# EAGLE design 2021-03-01_HALO_Main_Board (EAGLE 9.6.2)
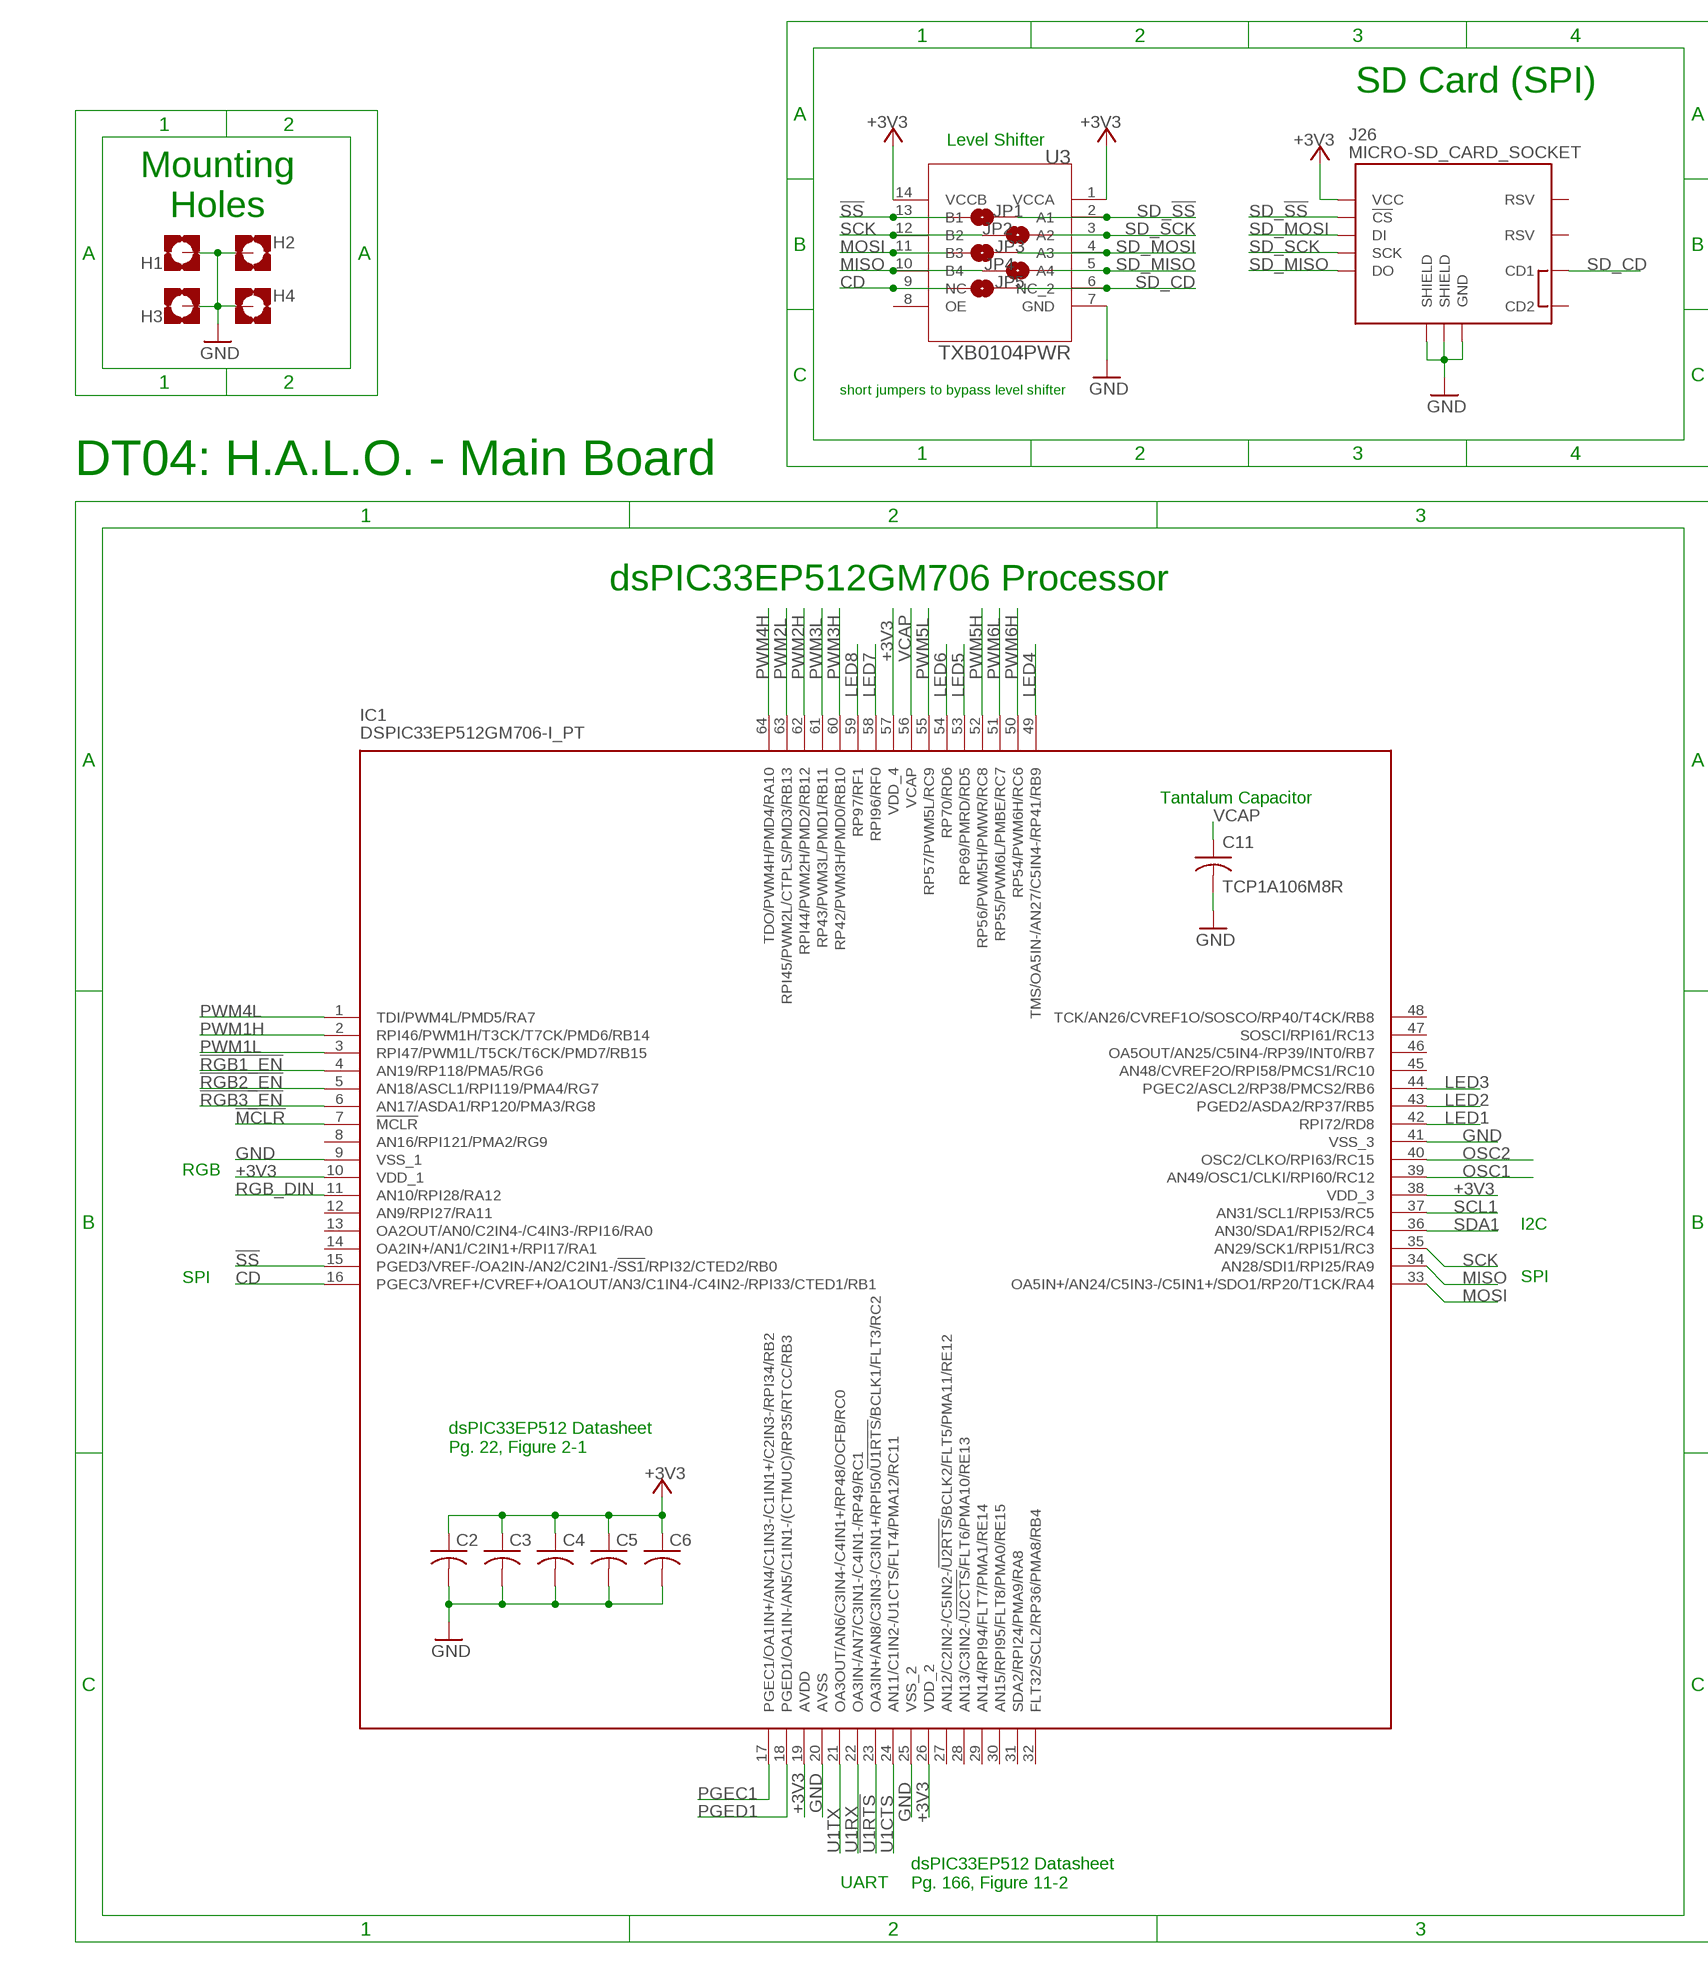
[diagram p0: schematic, sheet 1, part 1 of 2]
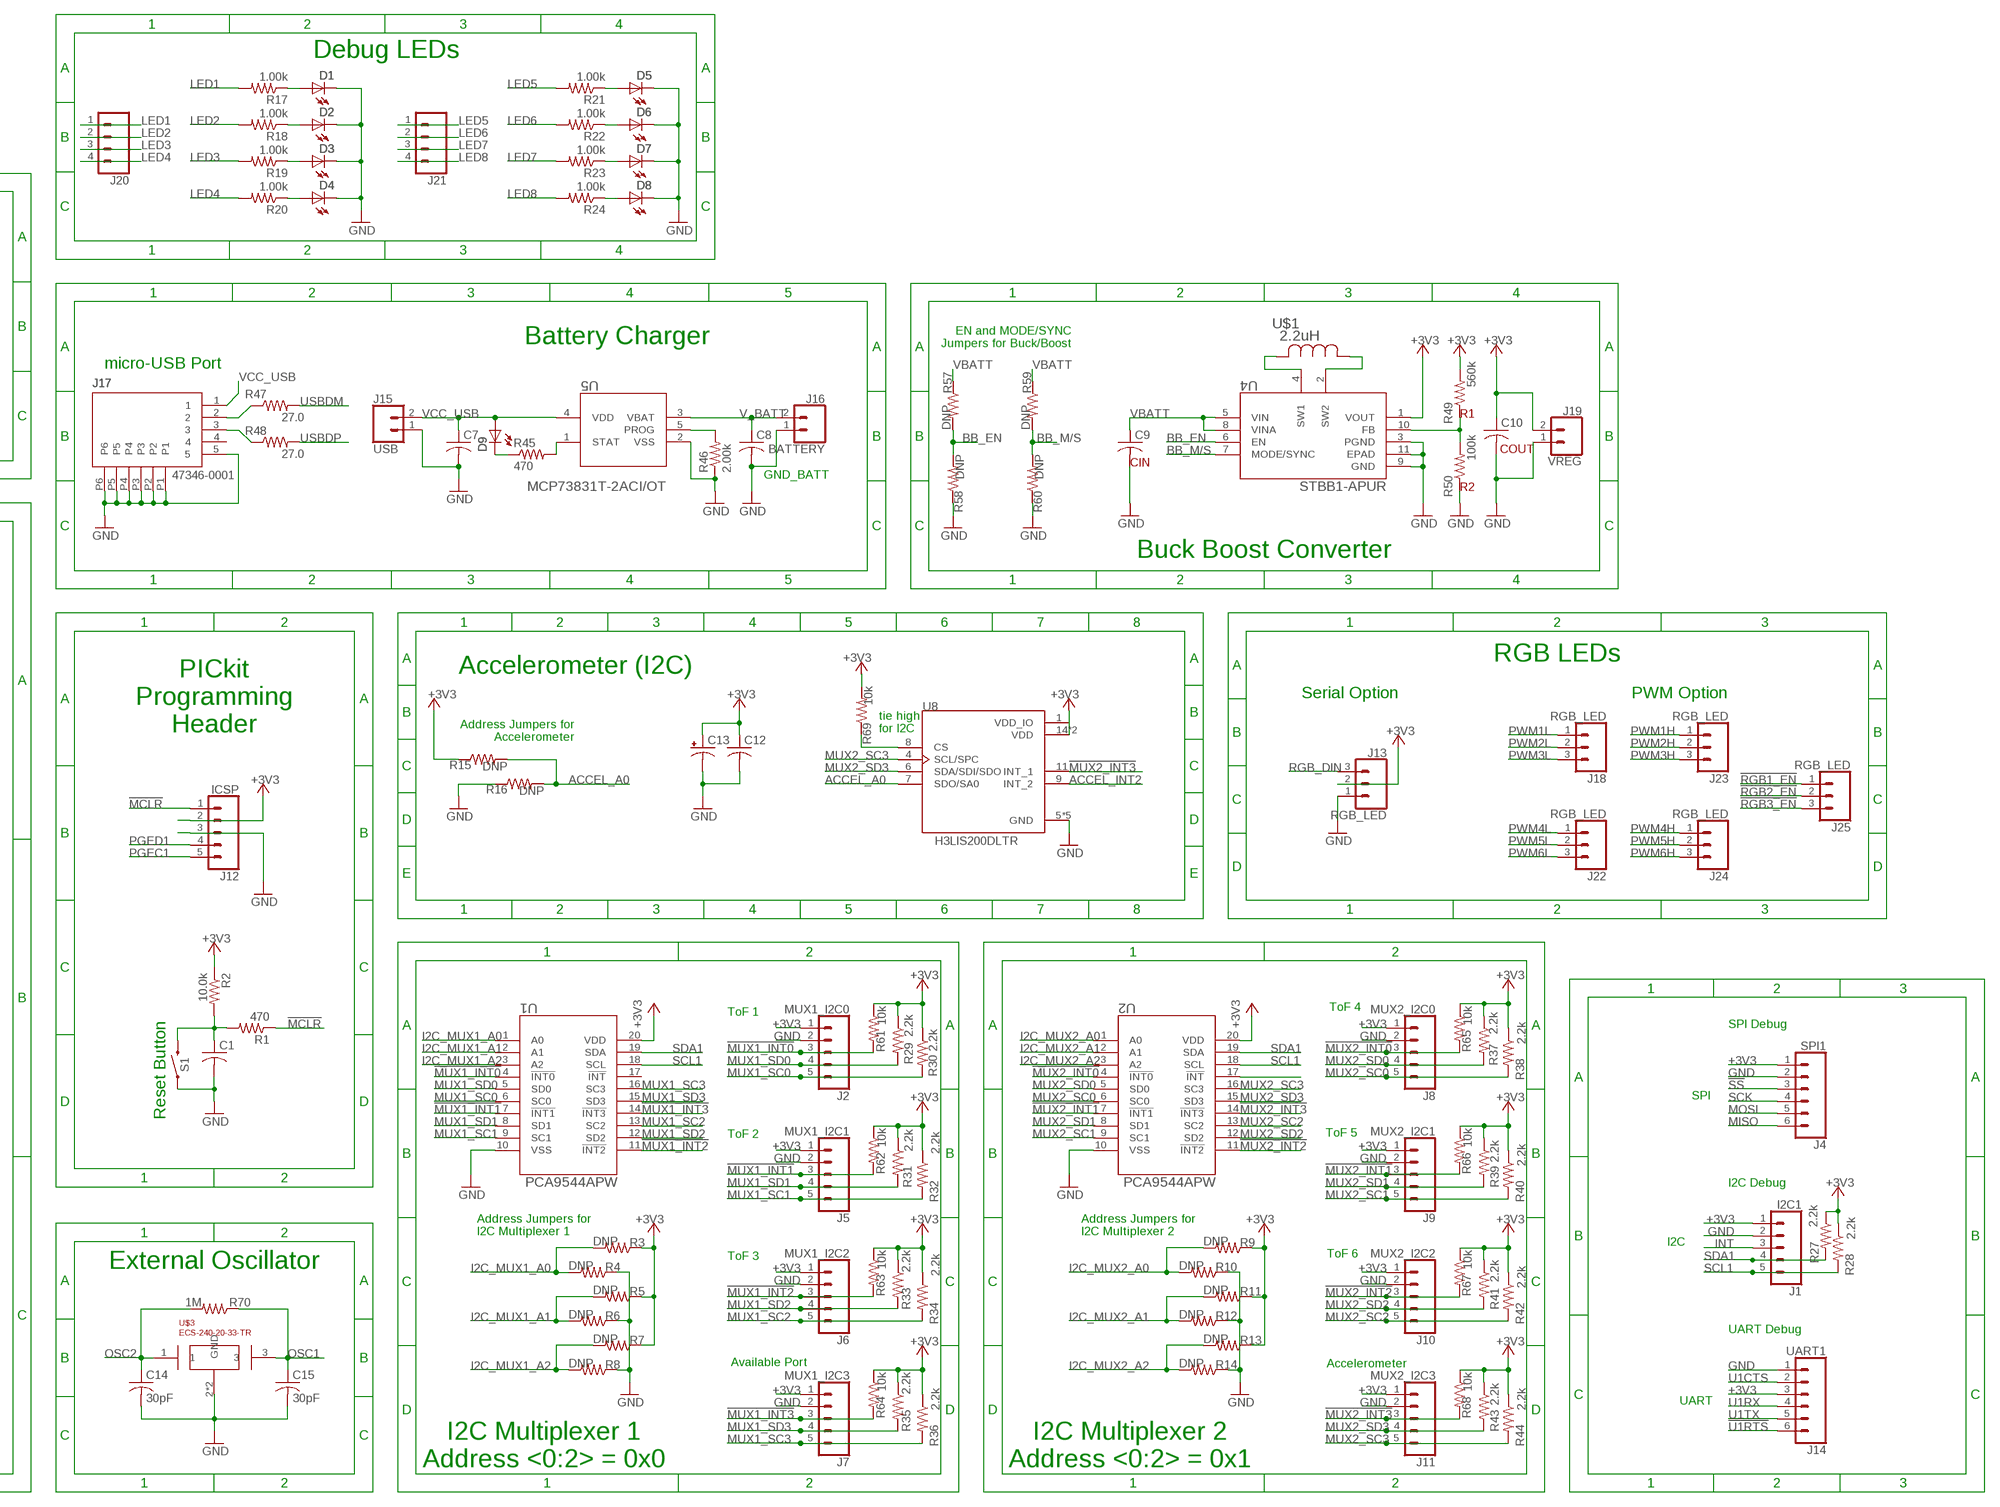
[diagram p1: schematic, sheet 1, part 2 of 2]

## Parts
C1  0.1uF  C-USC0805  [C0805]
C2  0.1uF  C-USC0805  [C0805]
C3  0.1uF  C-USC0805  [C0805]
C4  0.1uF  C-USC0805  [C0805]
C5  0.1uF  C-USC0805  [C0805]
C6  0.1uF  C-USC0805  [C0805]
C7  4.7uF  C-USC0805  [C0805]
C8  4.7uF  C-USC0805  [C0805]
C9  10uF  C-USC0805  [C0805]
C10  22uF  C-USC0805  [C0805]
C11  TCP1A106M8R  [TCP_ROM]
C12  0.1uF  C-USC0805  [C0805]
C13  10uF  10UF-POLAR-EIA3216-16V-10%(TANT)  [EIA3216]
C14  30pF  C-USC0805  [C0805]
C15  30pF  C-USC0805  [C0805]
D1  CHIP-LED0805  [CHIP-LED0805]
D2  CHIP-LED0805  [CHIP-LED0805]
D3  CHIP-LED0805  [CHIP-LED0805]
D4  CHIP-LED0805  [CHIP-LED0805]
D5  CHIP-LED0805  [CHIP-LED0805]
D6  CHIP-LED0805  [CHIP-LED0805]
D7  CHIP-LED0805  [CHIP-LED0805]
D8  CHIP-LED0805  [CHIP-LED0805]
D9  CHIP-LED0805  [CHIP-LED0805]
H1  MOUNT-PAD-SQUARE3.0  [3,0-PAD-SQUARE]
H2  MOUNT-PAD-SQUARE3.0  [3,0-PAD-SQUARE]
H3  MOUNT-PAD-SQUARE3.0  [3,0-PAD-SQUARE]
H4  MOUNT-PAD-SQUARE3.0  [3,0-PAD-SQUARE]
IC1  DSPIC33EP512GM706-I_PT  [QFP50P1200X1200X120-64N]
J1  I2C1  CONN_05  [1X05]
J2  MUX1_I2C0  CONN_05  [1X05]
J4  SPI1  CONN_06SILK_FEMALE_PTH  [1X06]
J5  MUX1_I2C1  CONN_05  [1X05]
J6  MUX1_I2C2  CONN_05  [1X05]
J7  MUX1_I2C3  CONN_05  [1X05]
J8  MUX2_I2C0  CONN_05  [1X05]
J9  MUX2_I2C1  CONN_05  [1X05]
J10  MUX2_I2C2  CONN_05  [1X05]
J11  MUX2_I2C3  CONN_05  [1X05]
J12  ICSP  CONN_05  [1X05]
J13  RGB_LED  CONN_03LOCK  [1X03_LOCK]
J14  UART1  CONN_06SILK_FEMALE_PTH  [1X06]
J15  USB  CONN_02  [1X02]
J16  BATTERY  CONN_02  [1X02]
J17  47346-0001  AS-ITM-00021  [MICRO_USB]
J18  RGB_LED  CONN_03LOCK  [1X03_LOCK]
J19  VREG  CONN_02  [1X02]
J20  CONN_04  [1X04]
J21  CONN_04  [1X04]
J22  RGB_LED  CONN_03LOCK  [1X03_LOCK]
J23  RGB_LED  CONN_03LOCK  [1X03_LOCK]
J24  RGB_LED  CONN_03LOCK  [1X03_LOCK]
J25  RGB_LED  CONN_03LOCK  [1X03_LOCK]
J26  MICRO-SD_CARD_SOCKET  [MICRO-SD-SOCKET]
JP1  JUMPER-SMT_2_NO_NO-SILK  [SMT-JUMPER_2_NO_NO-SILK]
JP2  JUMPER-SMT_2_NO_NO-SILK  [SMT-JUMPER_2_NO_NO-SILK]
JP3  JUMPER-SMT_2_NO_NO-SILK  [SMT-JUMPER_2_NO_NO-SILK]
JP4  JUMPER-SMT_2_NO_NO-SILK  [SMT-JUMPER_2_NO_NO-SILK]
JP5  JUMPER-SMT_2_NO_NO-SILK  [SMT-JUMPER_2_NO_NO-SILK]
R1  470  R-US_R0805  [R0805]
R2  10.0k  R-US_R0805  [R0805]
R3  DNP  R-US_R0805  [R0805]
R4  DNP  R-US_R0805  [R0805]
R5  DNP  R-US_R0805  [R0805]
R6  DNP  R-US_R0805  [R0805]
R7  DNP  R-US_R0805  [R0805]
R8  DNP  R-US_R0805  [R0805]
R9  DNP  R-US_R0805  [R0805]
R10  DNP  R-US_R0805  [R0805]
R11  DNP  R-US_R0805  [R0805]
R12  DNP  R-US_R0805  [R0805]
R13  DNP  R-US_R0805  [R0805]
R14  DNP  R-US_R0805  [R0805]
R15  DNP  R-US_R0805  [R0805]
R16  DNP  R-US_R0805  [R0805]
R17  1.00k  R-US_R0805  [R0805]
R18  1.00k  R-US_R0805  [R0805]
R19  1.00k  R-US_R0805  [R0805]
R20  1.00k  R-US_R0805  [R0805]
R21  1.00k  R-US_R0805  [R0805]
R22  1.00k  R-US_R0805  [R0805]
R23  1.00k  R-US_R0805  [R0805]
R24  1.00k  R-US_R0805  [R0805]
R27  2.2k  R-US_R0805  [R0805]
R28  2.2k  R-US_R0805  [R0805]
R29  2.2k  R-US_R0805  [R0805]
R30  2.2k  R-US_R0805  [R0805]
R31  2.2k  R-US_R0805  [R0805]
R32  2.2k  R-US_R0805  [R0805]
R33  2.2k  R-US_R0805  [R0805]
R34  2.2k  R-US_R0805  [R0805]
R35  2.2k  R-US_R0805  [R0805]
R36  2.2k  R-US_R0805  [R0805]
R37  2.2k  R-US_R0805  [R0805]
R38  2.2k  R-US_R0805  [R0805]
R39  2.2k  R-US_R0805  [R0805]
R40  2.2k  R-US_R0805  [R0805]
R41  2.2k  R-US_R0805  [R0805]
R42  2.2k  R-US_R0805  [R0805]
R43  2.2k  R-US_R0805  [R0805]
R44  2.2k  R-US_R0805  [R0805]
R45  470  R-US_R0805  [R0805]
R46  2.00k  R-US_R0805  [R0805]
R47  27.0  R-US_R0805  [R0805]
R48  27.0  R-US_R0805  [R0805]
R49  560k  R-US_R0805  [R0805]
R50  100k  R-US_R0805  [R0805]
R57  DNP  R-US_R0805  [R0805]
R58  DNP  R-US_R0805  [R0805]
R59  DNP  R-US_R0805  [R0805]
R60  DNP  R-US_R0805  [R0805]
R61  10k  R-US_R0805  [R0805]
R62  10k  R-US_R0805  [R0805]
R63  10k  R-US_R0805  [R0805]
R64  10k  R-US_R0805  [R0805]
R65  10k  R-US_R0805  [R0805]
R66  10k  R-US_R0805  [R0805]
R67  10k  R-US_R0805  [R0805]
R68  10k  R-US_R0805  [R0805]
R69  10k  R-US_R0805  [R0805]
R70  1M  R-US_R0805  [R0805]
S1  SWITCH-MOMENTARY-2SMD-4  [TACTILE_SWITCH_TALL]
U1  PCA9544APW  [SOT360-1_NXP]
U2  PCA9544APW  [SOT360-1_NXP]
U3  TXB0104PWR  [PW14]
U4  STBB1-APUR  [SON_B1-APUR_STM]
U5  MCP73831T-2ACI/OT  [SOT-23-5_MC_MCH]
U8  H3LIS200DLTR  [PQFN50P300X300X100-16N]
U$1  2.2uH  IND  [IND_4028_TDK]
U$3  ECS-240-20-33-TR  [ECX-32]

## Nets
!MCLR: IC1.7(!MCLR) J12.1 R1.1
!MUX1_INT0: J2.3 R61.2 U1.4(!INT0)
!MUX1_INT1: J5.3 R62.2 U1.7(!INT1)
!MUX1_INT2: J6.3 R63.2 U1.11(!INT2)
!MUX1_INT3: J7.3 R64.2 U1.14(!INT3)
!MUX2_INT0: J8.3 R65.2 U2.4(!INT0)
!MUX2_INT1: J9.3 R66.2 U2.7(!INT1)
!MUX2_INT2: J10.3 R67.2 U2.11(!INT2)
!MUX2_INT3: J11.3 R68.2 U2.14(!INT3) U8.11(INT_1)
!RGB1_EN: IC1.4(AN19/RP118/PMA5/RG6) J25.1
!RGB2_EN: IC1.5(AN18/ASCL1/RPI119/PMA4/RG7) J25.2
!RGB3_EN: IC1.6(AN17/ASDA1/RP120/PMA3/RG8) J25.3
!SS: IC1.15(PGED3/VREF-/OA2IN-/AN2/C2IN1-/!SS1!/RPI32/CTED2/RB0) J4.3 JP1.2 U3.13(B1)
!U1RTS: IC1.23(OA3IN+/AN8/C3IN3-/C3IN1+/RPI50/!U1RTS!/BCLK1/FLT3/RC2) J14.6
+3V3: C2.1 C3.1 C4.1 C5.1 C6.1 C10.1 C12.1 C13.+ IC1.10(VDD_1) IC1.19(AVDD) IC1.26(VDD_2) IC1.38(VDD_3) IC1.57(VDD_4) J1.1 J2.1 J4.1 J5.1 J6.1 J7.1 J8.1 J9.1 J10.1 J11.1 J12.2 J13.2 J14.3 J19.2 J26.VCC R2.1 R3.1 R5.1 R7.1 R9.1 R11.1 R13.1 R15.1 R27.1 R28.1 R29.1 R30.1 R31.1 R32.1 R33.1 R34.1 R35.1 R36.1 R37.1 R38.1 R39.1 R40.1 R41.1 R42.1 R43.1 R44.1 R49.2 R61.1 R62.1 R63.1 R64.1 R65.1 R66.1 R67.1 R68.1 R69.2 U1.20(VDD) U2.20(VDD) U3.1(VCCA) U3.14(VCCB) U4.1(VOUT) U8.1(VDD_IO) U8.14(VDD) U8.15(VDD)
ACCEL_A0: R15.2 R16.2 U8.7(SDO/SA0)
ACCEL_INT2: U8.9(INT_2)
BB_EN: R57.2 R58.2 U4.6(EN)
BB_M/S: R59.2 R60.2 U4.7(MODE/SYNC)
CD: IC1.16(PGEC3/VREF+/CVREF+/OA1OUT/AN3/C1IN4-/C4IN2-/RPI33/CTED1/RB1) JP5.2 U3.9(NC)
GND: C1.2 C2.2 C3.2 C4.2 C5.2 C6.2 C7.2 C8.2 C9.2 C10.2 C11.2 C12.2 C13.- C14.2 C15.2 D1.C D2.C D3.C D4.C D5.C D6.C D7.C D8.C H1.B3,0(MOUNT) H2.B3,0(MOUNT) H3.B3,0(MOUNT) H4.B3,0(MOUNT) IC1.9(VSS_1) IC1.20(AVSS) IC1.25(VSS_2) IC1.41(VSS_3) J1.2 J2.2 J4.2 J5.2 J6.2 J7.2 J8.2 J9.2 J10.2 J11.2 J12.3 J13.1 J14.1 J15.1 J16.1 J17.5 J17.P1 J17.P2 J17.P3 J17.P4 J17.P5 J17.P6 J19.1 J26.GND J26.GND1(SHIELD) J26.GND3(SHIELD) R4.1 R6.1 R8.1 R10.1 R12.1 R14.1 R16.1 R46.1 R50.1 R58.1 R60.1 S1.A2 U1.10(VSS) U2.10(VSS) U3.7(GND) U4.3(PGND) U4.9(GND) U4.11(EPAD) U5.2(VSS) U8.5(GND) U8.10(GND) U8.12(GND) U8.13(GND) U8.16(GND) U$3.2(GND) U$3.4(GND)
I2C_MUX1_A0: R3.2 R4.2 U1.1(A0)
I2C_MUX1_A1: R5.2 R6.2 U1.2(A1)
I2C_MUX1_A2: R7.2 R8.2 U1.3(A2)
I2C_MUX2_A0: R9.2 R10.2 U2.1(A0)
I2C_MUX2_A1: R11.2 R12.2 U2.2(A1)
I2C_MUX2_A2: R13.2 R14.2 U2.3(A2)
INT: J1.3
LED1: IC1.42(RPI72/RD8) J20.1 R17.2
LED2: IC1.43(PGED2/ASDA2/RP37/RB5) J20.2 R18.2
LED3: IC1.44(PGEC2/ASCL2/RP38/PMCS2/RB6) J20.3 R19.2
LED4: IC1.49(TMS/OA5IN-/AN27/C5IN4-/RP41/RB9) J20.4 R20.2
LED5: IC1.53(RP69/PMRD/RD5) J21.1 R21.2
LED6: IC1.54(RP70/RD6) J21.2 R22.2
LED7: IC1.58(RPI96/RF0) J21.3 R23.2
LED8: IC1.59(RP97/RF1) J21.4 R24.2
MISO: IC1.34(AN28/SDI1/RPI25/RA9) J4.6 JP4.2 U3.10(B4)
MOSI: IC1.33(OA5IN+/AN24/C5IN3-/C5IN1+/SDO1/RP20/T1CK/RA4) J4.5 JP3.2 U3.11(B3)
MUX1_SC0: J2.5 R30.2 U1.6(SC0)
MUX1_SC1: J5.5 R32.2 U1.9(SC1)
MUX1_SC2: J6.5 R34.2 U1.13(SC2)
MUX1_SC3: J7.5 R36.2 U1.16(SC3)
MUX1_SD0: J2.4 R29.2 U1.5(SD0)
MUX1_SD1: J5.4 R31.2 U1.8(SD1)
MUX1_SD2: J6.4 R33.2 U1.12(SD2)
MUX1_SD3: J7.4 R35.2 U1.15(SD3)
MUX2_SC0: J8.5 R38.2 U2.6(SC0)
MUX2_SC1: J9.5 R40.2 U2.9(SC1)
MUX2_SC2: J10.5 R42.2 U2.13(SC2)
MUX2_SC3: J11.5 R44.2 U2.16(SC3) U8.4(SCL/SPC)
MUX2_SD0: J8.4 R37.2 U2.5(SD0)
MUX2_SD1: J9.4 R39.2 U2.8(SD1)
MUX2_SD2: J10.4 R41.2 U2.12(SD2)
MUX2_SD3: J11.4 R43.2 U2.15(SD3) U8.6(SDA/SDI/SDO)
N$1: C1.1 R1.2 R2.2 S1.B2
N$2: R69.1 U8.8(CS)
N$5: D1.A R17.1
N$6: J17.2 R47.1
N$7: D2.A R18.1
N$8: D9.C R45.1
N$9: R49.1 R50.2 U4.10(FB)
N$10: D3.A R19.1
N$11: D4.A R20.1
N$12: D5.A R21.1
N$13: D6.A R22.1
N$14: D7.A R23.1
N$15: D8.A R24.1
N$16: R45.2 U5.1(STAT)
N$17: J17.3 R48.1
N$18: U4.4(SW1) U$1.2
N$19: R46.2 U5.5(PROG)
N$20: U4.2(SW2) U$1.1
N$25: U2.17(!INT)
OSC1: C15.1 IC1.39(AN49/OSC1/CLKI/RPI60/RC12) R70.1 U$3.3
OSC2: C14.1 IC1.40(OSC2/CLKO/RPI63/RC15) R70.2 U$3.1
PGEC1: IC1.17(PGEC1/OA1IN+/AN4/C1IN3-/C1IN1+/C2IN3-/RPI34/RB2) J12.5
PGED1: IC1.18(PGED1/OA1IN-/AN5/C1IN1-/(CTMUC)/RP35/RTCC/RB3) J12.4
PWM1H: IC1.2(RPI46/PWM1H/T3CK/T7CK/PMD6/RB14) J23.1
PWM1L: IC1.3(RPI47/PWM1L/T5CK/T6CK/PMD7/RB15) J18.1
PWM2H: IC1.62(RPI44/PWM2H/PMD2/RB12) J23.2
PWM2L: IC1.63(RPI45/PWM2L/CTPLS/PMD3/RB13) J18.2
PWM3H: IC1.60(RP42/PWM3H/PMD0/RB10) J23.3
PWM3L: IC1.61(RP43/PWM3L/PMD1/RB11) J18.3
PWM4H: IC1.64(TDO/PWM4H/PMD4/RA10) J24.1
PWM4L: IC1.1(TDI/PWM4L/PMD5/RA7) J22.1
PWM5H: IC1.52(RP56/PWM5H/PMWR/RC8) J24.2
PWM5L: IC1.55(RP57/PWM5L/RC9) J22.2
PWM6H: IC1.50(RP54/PWM6H/RC6) J24.3
PWM6L: IC1.51(RP55/PWM6L/PMBE/RC7) J22.3
RGB_DIN: IC1.11(AN10/RPI28/RA12) J13.3
SCK: IC1.35(AN29/SCK1/RPI51/RC3) J4.4 JP2.2 U3.12(B2)
SCL1: IC1.37(AN31/SCL1/RPI53/RC5) J1.5 R28.2 U1.18(SCL) U2.18(SCL)
SD_!SS: J26.CS(!CS) JP1.1 U3.2(A1)
SD_CD: J26.CD1 JP5.1 U3.6(NC_2)
SD_MISO: J26.DO JP4.1 U3.5(A4)
SD_MOSI: J26.DI JP3.1 U3.4(A3)
SD_SCK: J26.SCLK(SCK) JP2.1 U3.3(A2)
SDA1: IC1.36(AN30/SDA1/RPI52/RC4) J1.4 R27.2 U1.19(SDA) U2.19(SDA)
U1CTS: IC1.24(AN11/C1IN2-/U1CTS/FLT4/PMA12/RC11) J14.2
U1RX: IC1.22(OA3IN-/AN7/C3IN1-/C4IN1-/RP49/RC1) J14.4
U1TX: IC1.21(OA3OUT/AN6/C3IN4-/C4IN1+/RP48/OCFB/RC0) J14.5
USBDM: R47.2
USBDP: R48.2
V_BATT: C8.1 J16.2 U5.3(VBAT)
VBATT: C9.1 R57.1 R59.1 U4.5(VIN) U4.8(VINA)
VCAP: C11.1 IC1.56(VCAP)
VCC_USB: C7.1 D9.A J15.2 J17.1 U5.4(VDD)
Unconnected: IC1.8(AN16/RPI121/PMA2/RG9) IC1.12(AN9/RPI27/RA11) IC1.13(OA2OUT/AN0/C2IN4-/C4IN3-/RPI16/RA0) IC1.14(OA2IN+/AN1/C2IN1+/RPI17/RA1) IC1.27(AN12/C2IN2-/C5IN2-/!U2RTS!/BCLK2/FLT5/PMA11/RE12) IC1.28(AN13/C3IN2-/!U2CTS!/FLT6/PMA10/RE13) IC1.29(AN14/RPI94/FLT7/PMA1/RE14) IC1.30(AN15/RPI95/FLT8/PMA0/RE15) IC1.31(SDA2/RPI24/PMA9/RA8) IC1.32(FLT32/SCL2/RP36/PMA8/RB4) IC1.45(AN48/CVREF2O/RPI58/PMCS1/RC10) IC1.46(OA5OUT/AN25/C5IN4-/RP39/INT0/RB7) IC1.47(SOSCI/RPI61/RC13) IC1.48(TCK/AN26/CVREF1O/SOSCO/RP40/T4CK/RB8) J17.4 J26.CD2 J26.RSV1(RSV) J26.RSV2(RSV) U1.17(!INT) U3.8(OE)

## Notes on the sheet
- Debug LEDs
- SD Card (SPI)
- Level Shifter
- Mounting
  Holes
- EN and MODE/SYNC
  Jumpers for Buck/Boost
- Battery Charger
- micro-USB Port
- R1
- short jumpers to bypass level shifter
- COUT
- CIN
- GND_BATT
- DT04: H.A.L.O. - Main Board
- R2
- dsPIC33EP512GM706 Processor | Buck Boost Converter
- RGB LEDs
- Accelerometer (I2C)
- PICkit
  Programming
  Header
- Serial Option | PWM Option
- Tantalum Capacitor
- tie high
  for I2C
- Address Jumpers for
  Accelerometer
- ┏ 
  RGB
       ┃
       ┗
- ToF 4
- ┓ 
   I2C
  ┛
- ToF 1
- SPI Debug
- ┏ 
  SPI
     ┗
- ┓ 
   SPI
  ┃ 
  ┛
- Reset Button
- ToF 2 | ToF 5
- ┏ 
     ┃
     ┃
  SPI
     ┃
     ┃
     ┗
- dsPIC33EP512 Datasheet
  Pg. 22, Figure 2-1
- I2C Debug
- Address Jumpers for
  I2C Multiplexer 1
- Address Jumpers for
  I2C Multiplexer 2
- External Oscillator | ToF 3 | ToF 6
- ┏ 
     ┃
  I2C
     ┃
     ┃
     ┗
- UART Debug
- Available Port | Accelerometer
- ┏ 
        ┃
        ┃
  UART
        ┃
        ┃
        ┗
- ┗ UART┛
- dsPIC33EP512 Datasheet
  Pg. 166, Figure 11-2
- I2C Multiplexer 1
  Address <0:2> = 0x0
- I2C Multiplexer 2
  Address <0:2> = 0x1

## Library data of the parts
C1-C10 C12 = rcl:C-US: CAPACITOR, American symbol
C11 = HALO_Tant_Cap_Library:TCP1A106M8R; BUILT_BY: EMA_UL_Team; MANUFACTURER_PART_NUMBER: TCP1A106M8R; SOURCELIBRARY: Rohm_2014-12-31; VENDOR: ROHM Semiconductor
C13 = SparkFun-Capacitors:10UF-POLAR: 10.0µF polarized capacitors A capacitor is a passive two-terminal electrical component used to store electrical energy temporarily in an electric field.; PROD_ID: CAP-00811
C14 C15 = adafruit:C-US: CAPACITOR, American symbol
D1-D9 = UA_NASA_RMC-Diodes:CHIP-LED0805
H1-H4 = holes:MOUNT-PAD-SQUARE: MOUNTING PAD, square
IC1 = SamacSys_Parts:DSPIC33EP512GM706-I_PT: Microchip DSPIC33EP512GM706-I/PT, 16bit dsPIC Microcontroller, 60MHz, 512 kB Flash, 64-Pin TQFP Source: Datasheet <http://www.microchip.com/mymicrochip/filehandler.aspx?ddocname=en561674>; ARROW_PART_NUMBER: DSPIC33EP512GM706-I/PT; ARROW_PRICE-STOCK: https://www.arrow.com/en/products/dspic33ep512gm706-ipt/microchip-technology; DESCRIPTION: Microchip DSPIC33EP512GM706-I/PT, 16bit dsPIC Microcontroller, 60MHz, 512 kB Flash, 64-Pin TQFP; HEIGHT: 1.2mm; MANUFACTURER_NAME: Microchip; MANUFACTURER_PART_NUMBER: DSPIC33EP512GM706-I/PT; MOUSER_PART_NUMBER: 579-512GM706-I/PT; MOUSER_PRICE-STOCK: https://www.mouser.com/Search/Refine.aspx?Keyword=579-512GM706-I%2FPT
J1 J2 J5-J12 = SparkFun-Connectors:CONN_05: Multi connection point. Often used as Generic Header-pin footprint for 0.1 inch spaced/style header connections On any of the 0.1 inch spaced packages, you can populate with these: Break Away Headers - Straight <https://www.sparkfun.com/products/116> (PRT-00116) Break Away Male Headers - Right Angle <https://www.sparkfun.com/products/553> (PRT-00553) Female Headers <https://www.sparkfun.com/products/115> (PRT-00115) Break Away Headers - Machine Pin <https://www.sparkfun.com/products/117> (PRT-00117) Break Away Female Headers - Swiss Machine Pin <https://www.sparkfun.com/products/743> (PRT-00743) For SCREWTERMINALS and SPRING TERMINALS visit here: Screw Terimnals on SparkFun.com <https://www.sparkfun.com/search/results?term=Screw+Terminals> (5mm/3.5mm/2.54mm spacing) This device is also useful as a general connection point to wire up your design to another part of your project. Our various solder wires solder well into these plated through hole pads. Hook-Up Wire - Assortment (Stranded, 22 AWG) <https://www.sparkfun.com/products/11375> (PRT-11375) Hook-Up Wire - Assortment (Solid Core, 22 AWG) <https://www.sparkfun.com/products/11367> (PRT-11367) View the entire wire category on our website here <https://www.sparkfun.com/categories/141> Special notes: Molex polarized connector foot print use with SKU : PRT-08231 with associated crimp pins and housings. 1MM SMD Version SKU: PRT-10208
J4 J14 = SparkFun-Connectors:CONN_06: Multi connection point. Often used as Generic Header-pin footprint for 0.1 inch spaced/style header connections On any of the 0.1 inch spaced packages, you can populate with these: Break Away Headers - Straight <https://www.sparkfun.com/products/116> (PRT-00116) Break Away Male Headers - Right Angle <https://www.sparkfun.com/products/553> (PRT-00553) Female Headers <https://www.sparkfun.com/products/115> (PRT-00115) Break Away Headers - Machine Pin <https://www.sparkfun.com/products/117> (PRT-00117) Break Away Female Headers - Swiss Machine Pin <https://www.sparkfun.com/products/743> (PRT-00743) Arduino Stackable Header - 6 Pin <https://www.sparkfun.com/products/9280> (PRT-09280) For SCREWTERMINALS and SPRING TERMINALS visit here: Screw Terimnals on SparkFun.com <https://www.sparkfun.com/search/results?term=Screw+Terminals> (5mm/3.5mm/2.54mm spacing) This device is also useful as a general connection point to wire up your design to another part of your project. Our various solder wires solder well into these plated through hole pads. Hook-Up Wire - Assortment (Stranded, 22 AWG) <https://www.sparkfun.com/products/11375> (PRT-11375) Hook-Up Wire - Assortment (Solid Core, 22 AWG) <https://www.sparkfun.com/products/11367> (PRT-11367) View the entire wire category on our website here <https://www.sparkfun.com/categories/141>; PROD_ID: CONN-08437
J13 J18 J22-J25 = SparkFun-Connectors:CONN_03: Multi connection point. Often used as Generic Header-pin footprint for 0.1 inch spaced/style header connections On any of the 0.1 inch spaced packages, you can populate with these: Break Away Headers - Straight <https://www.sparkfun.com/products/116> (PRT-00116) Break Away Male Headers - Right Angle <https://www.sparkfun.com/products/553> (PRT-00553) Female Headers <https://www.sparkfun.com/products/115> (PRT-00115) Break Away Headers - Machine Pin <https://www.sparkfun.com/products/117> (PRT-00117) Break Away Female Headers - Swiss Machine Pin <https://www.sparkfun.com/products/743> (PRT-00743) Stackable Header - 3 Pin (Female, 0.1") <https://www.sparkfun.com/products/13875> (PRT-13875) For SCREWTERMINALS and SPRING TERMINALS visit here: Screw Terimnals on SparkFun.com <https://www.sparkfun.com/search/results?term=Screw+Terminals> (5mm/3.5mm/2.54mm spacing) This device is also useful as a general connection point to wire up your design to another part of your project. Our various solder wires solder well into these plated through hole pads. Hook-Up Wire - Assortment (Stranded, 22 AWG) <https://www.sparkfun.com/products/11375> (PRT-11375) Hook-Up Wire - Assortment (Solid Core, 22 AWG) <https://www.sparkfun.com/products/11367> (PRT-11367) View the entire wire category on our website here <https://www.sparkfun.com/categories/141> Special notes: Molex polarized connector foot print use with SKU : PRT-08232 with associated crimp pins and housings.
J15 J16 J19 = SparkFun-Connectors:CONN_02: Multi connection point. Often used as Generic Header-pin footprint for 0.1 inch spaced/style header connections On any of the 0.1 inch spaced packages, you can populate with these: Break Away Headers - Straight <https://www.sparkfun.com/products/116> (PRT-00116) Break Away Male Headers - Right Angle <https://www.sparkfun.com/products/553> (PRT-00553) Female Headers <https://www.sparkfun.com/products/115> (PRT-00115) Break Away Headers - Machine Pin <https://www.sparkfun.com/products/117> (PRT-00117) Break Away Female Headers - Swiss Machine Pin <https://www.sparkfun.com/products/743> (PRT-00743) For SCREWTERMINALS and SPRING TERMINALS visit here: Screw Terimnals on SparkFun.com <https://www.sparkfun.com/search/results?term=Screw+Terminals> (5mm/3.5mm/2.54mm spacing) This device is also useful as a general connection point to wire up your design to another part of your project. Our various solder wires solder well into these plated through hole pads. Hook-Up Wire - Assortment (Stranded, 22 AWG) <https://www.sparkfun.com/products/11375> (PRT-11375) Hook-Up Wire - Assortment (Solid Core, 22 AWG) <https://www.sparkfun.com/products/11367> (PRT-11367) View the entire wire category on our website here <https://www.sparkfun.com/categories/141> Special notes: Molex polarized connector foot print use with: PRT-08233 with associated crimp pins and housings. 2.54_SCREWTERM for use with PRT-10571. 3.5mm Screw Terminal footprints for PRT-08084 5mm Screw Terminal footprints for use with PRT-08432
J17 = tinycircuits:AS-ITM-00021: CONN RCPT 5POS MICRO USB R/A; PARTNO: AS-ITM-00021; PNPROTATION: 90
J20 J21 = SparkFun-Connectors:CONN_04: Multi connection point. Often used as Generic Header-pin footprint for 0.1 inch spaced/style header connections On any of the 0.1 inch spaced packages, you can populate with these: Break Away Headers - Straight <https://www.sparkfun.com/products/116> (PRT-00116) Break Away Male Headers - Right Angle <https://www.sparkfun.com/products/553> (PRT-00553) Female Headers <https://www.sparkfun.com/products/115> (PRT-00115) Break Away Headers - Machine Pin <https://www.sparkfun.com/products/117> (PRT-00117) Break Away Female Headers - Swiss Machine Pin <https://www.sparkfun.com/products/743> (PRT-00743) For SCREWTERMINALS and SPRING TERMINALS visit here: Screw Terimnals on SparkFun.com <https://www.sparkfun.com/search/results?term=Screw+Terminals> (5mm/3.5mm/2.54mm spacing) This device is also useful as a general connection point to wire up your design to another part of your project. Our various solder wires solder well into these plated through hole pads. Hook-Up Wire - Assortment (Stranded, 22 AWG) <https://www.sparkfun.com/products/11375> (PRT-11375) Hook-Up Wire - Assortment (Solid Core, 22 AWG) <https://www.sparkfun.com/products/11367> (PRT-11367) View the entire wire category on our website here <https://www.sparkfun.com/categories/141> Special notes: Molex polarized connector foot print use with SKU : PRT-08231 with associated crimp pins and housings. 1MM SMD Version SKU: PRT-10208; PROD_ID: CONN-09696
J26 = SparkFun-Connectors:MICRO-SD_CARD_SOCKET: microSD Socket for Transflash Push-push type µSD socket. tDoc lines correctly indicate media card edge positions when inserting (unlocked, locked, depressed). NOTE: CD1 and CD2 are connected internally, and the default detect state of the socket is detect pin to ground. SparkFun Products: WAV Trigger <https://www.sparkfun.com/products/13660> CAN-Bus Shield <https://www.sparkfun.com/products/13262> SparkFun Level Shifing microSD Breakout <https://www.sparkfun.com/products/13743>; PROD_ID: CONN-07820; SF_ID: PRT-00127
JP1-JP5 = SparkFun-Jumpers:JUMPER-SMT_2_NO: Normally open jumper This jumper has two pads in close proximity to each other. Apply solder to close the connection. Round pads are easier to solder for beginners, but are a lot larger. SparkFun Product that uses the round pads: SparkFun EL Sequencer <https://www.sparkfun.com/products/12781>
R1-R24 R27-R50 R57-R70 = rcl:R-US_: RESISTOR, American symbol
S1 = UA_NASA_RMC-Switches:SWITCH-MOMENTARY-2: Various NO switches- pushbuttons, reed, etc Series: PTS645; PROD_ID: SWCH-11966
U1 U2 = I2C_Multiplexer:PCA9544APW; BUILT_BY: EMA_UL_Team; MANUFACTURER_PART_NUMBER: PCA9544APW; SOURCELIBRARY: NXP_2011-11-10; VENDOR: NXP
U3 = Level_Shifter_TXB0104PWR:TXB0104PWR; DATASHEET_URL: http://www.ti.com/lit/gpn/TXB0104; DESCRIPTION: 4-Bit Bidirectional Voltage-Level Translator with Auto Direction Sensing and +/-15 kV ESD Protect; FAMILY_NAME: AUTO DIRECTION SENSING DUAL SUPPLY TRANSLATOR; GENERIC_PART_NUMBER: TXB0104; INDUSTRY_STD_PKG_TYPE: TSSOP; MANUFACTURER: Texas Instruments; MANUFACTURER_PART_NUMBER: TXB0104PWR; PACKAGE_DESIGNATOR: PW; PIN_COUNT: 14; VENDOR: Texas Instruments
U4 = HALO_Buck_Boost:STBB1-APUR; BUILT_BY: EMA_Matt; DATASHEET: https://datasheet.octopart.com/STBB1-APUR-STMicroelectronics-datasheet-10837531.pdf; MANUFACTURER_PART_NUMBER: STBB1-APUR; SOURCELIBRARY: Updates_to_database_2020-11-13; VENDOR: STMicroelectronics
U5 = HALO_Batt_Charger:MCP73831T-2ACI/OT; BUILT_BY: EMA_UL_Team; MANUFACTURER_PART_NUMBER: MCP73831T-2ACI/OT; SOURCELIBRARY: Microchip_2011-05-13; VENDOR: Microchip
U8 = H3LIS200DLTR:H3LIS200DLTR: H3LIS200DL Series 3.6 V 400 Hz Low-Power 3-Axis Digital Accelerometer -TFLGA-16L; DESCRIPTION: Accelerometer X, Y, Z Axis ±100g, ±200g 25Hz ~ 500Hz 16-TFLGA (3x3); DIGI-KEY_PART_NUMBER: 497-15698-1-ND; MF: STMicroelectronics; MP: H3LIS200DLTR; PACKAGE: TFLGA-16 STMicroelectronics; PURCHASE-URL: https://pricing.snapeda.com/search/part/H3LIS200DLTR/?ref=eda
U$1 = HALO_L_Buck_Boost:IND
U$3 = UA_NASA_RMC-Oscillators:ECS-240-20-33-TR

## Board
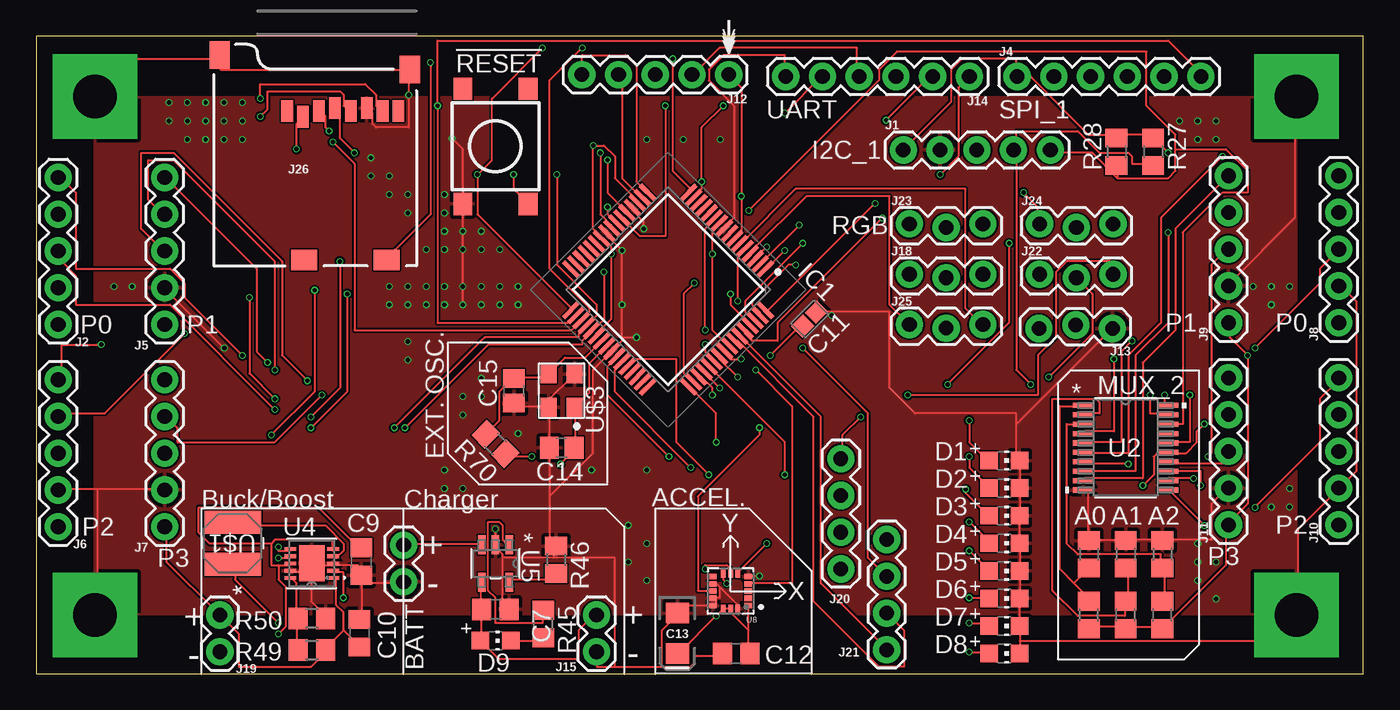
[diagram p2: board, top side]
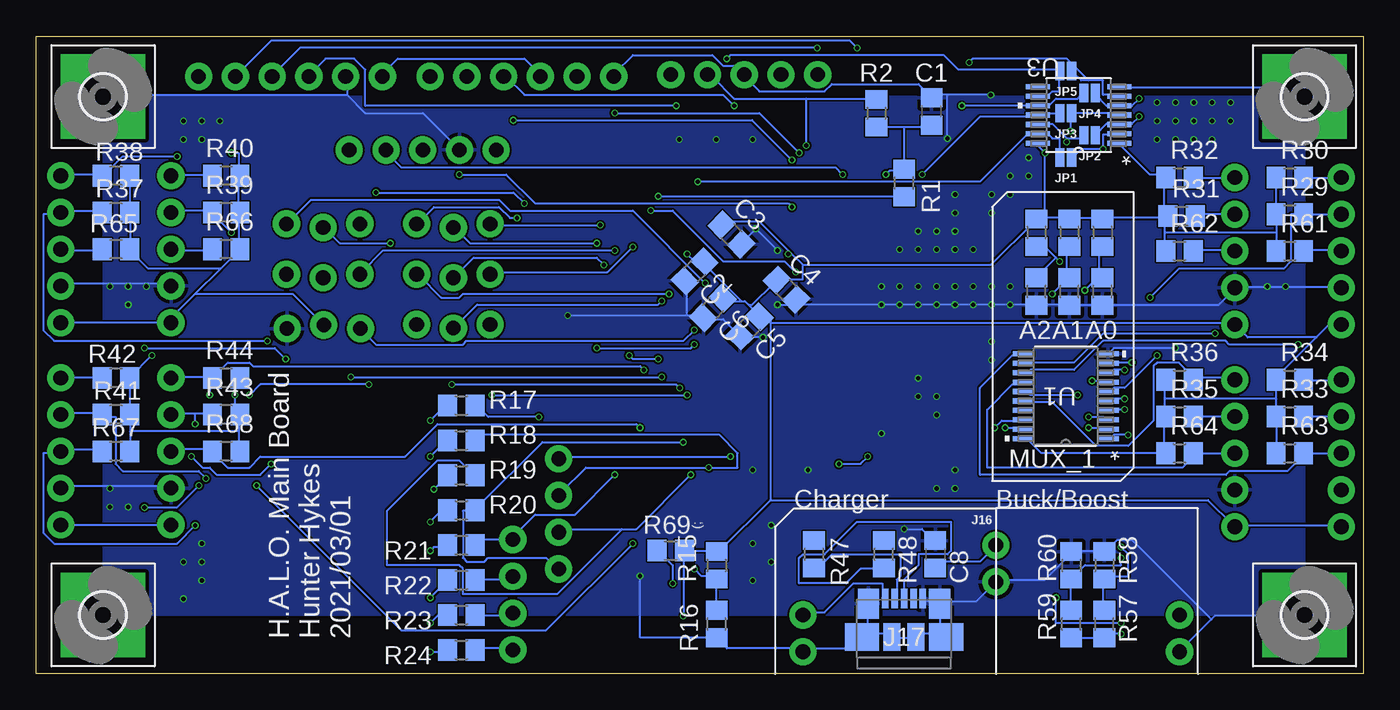
[diagram p3: board, bottom side, seen from below]

Size 91.75 x 44.06 mm. Coordinates in mm from the lower left corner, seen from the top.
Outline: 0,0 91.75,0 91.75,44.06 0,44.06 0,0
Copper layers (1*16): Top 0.035559375mm / dielectric 1.6mm / Bottom 0.035559375mm
Design rules "jlcpcb2layer": minimum track width 5mil, minimum drill 12mil, track to track 5mil, track to pad 5mil, pad to pad 5mil, via to via 5mil, smd to smd 5mil, copper to edge 8mil, drill to drill 6mil, minimum pad ring 5mil, minimum via ring 3mil, stop-mask expansion 2.5mil, vias tented up to drill 0mil, thermal gap 10mil

### Footprints (pad centres in the part's own frame; a part is rotated, then mirrored left to right if it is on the bottom)
C0805 = smd 1.3 x 1.5: 1 -0.95,0; 2 0.95,0
TCP_ROM = smd 1.167 x 1.092: 1 -0.674,0; 2 0.674,0
EIA3216 = smd 1.4 x 1.6: + 1.4,0; - -1.4,0
C0805' = smd 1.3 x 1.5: 1 -0.85,0; 2 0.85,0
CHIP-LED0805 = smd 1.2 x 1.2: A 0,-1.05; C 0,1.05
3,0-PAD-SQUARE = drill 3 pad 5.842 square: B3,0 0,0
QFP50P1200X1200X120-64N = smd 1.475 x 0.3: 1 -5.738,3.75; 2 -5.738,3.25; 3 -5.738,2.75; 4 -5.738,2.25; 5 -5.738,1.75; 6 -5.738,1.25; 7 -5.738,0.75; 8 -5.738,0.25; 9 -5.738,-0.25; 10 -5.738,-0.75; 11 -5.738,-1.25; 12 -5.738,-1.75; 13 -5.738,-2.25; 14 -5.738,-2.75; 15 -5.738,-3.25; 16 -5.738,-3.75; 33 5.738,-3.75; 34 5.738,-3.25; 35 5.738,-2.75; 36 5.738,-2.25; 37 5.738,-1.75; 38 5.738,-1.25; 39 5.738,-0.75; 40 5.738,-0.25; 41 5.738,0.25; 42 5.738,0.75; 43 5.738,1.25; 44 5.738,1.75; 45 5.738,2.25; 46 5.738,2.75; 47 5.738,3.25; 48 5.738,3.75 | smd 0.3 x 1.475: 17 -3.75,-5.738; 18 -3.25,-5.738; 19 -2.75,-5.738; 20 -2.25,-5.738; 21 -1.75,-5.738; 22 -1.25,-5.738; 23 -0.75,-5.738; 24 -0.25,-5.738; 25 0.25,-5.738; 26 0.75,-5.738; 27 1.25,-5.738; 28 1.75,-5.738; 29 2.25,-5.738; 30 2.75,-5.738; 31 3.25,-5.738; 32 3.75,-5.738; 49 3.75,5.738; 50 3.25,5.738; 51 2.75,5.738; 52 2.25,5.738; 53 1.75,5.738; 54 1.25,5.738; 55 0.75,5.738; 56 0.25,5.738; 57 -0.25,5.738; 58 -0.75,5.738; 59 -1.25,5.738; 60 -1.75,5.738; 61 -2.25,5.738; 62 -2.75,5.738; 63 -3.25,5.738; 64 -3.75,5.738
1X05 = drill 1.016 pad 1.88: 1 0,0; 2 2.54,0; 3 5.08,0; 4 7.62,0; 5 10.16,0
1X06 = drill 1.016 pad 1.88: 1 0,0; 2 2.54,0; 3 5.08,0; 4 7.62,0; 5 10.16,0; 6 12.7,0
1X03_LOCK = drill 1.016 pad 1.88: 1 0,0.127; 2 2.54,-0.127; 3 5.08,0.127
1X02 = drill 1.016 pad 1.88: 1 0,0; 2 2.54,0
MICRO_USB = smd 1.38 x 0.45: 1 2.66,1.3; 2 2.66,0.65; 3 2.66,0; 4 2.66,-0.65; 5 2.66,-1.3 | smd 2.1 x 1.475: P1 2.3,-2.462; P2 2.3,2.462 | smd 1.9 x 2.375: P3 0,2.913; P4 0,-2.913 | smd 1.9 x 1.175: P5 0,0.838; P6 0,-0.838
1X04 = drill 1.016 pad 1.88: 1 0,0; 2 2.54,0; 3 5.08,0; 4 7.62,0
MICRO-SD-SOCKET = smd 1.8 x 1.4: CD1 -2.05,0.4; CD2 -7.75,0.4 | smd 0.8 x 1.5: CS -7.84,10.3; DI -6.74,10.7; DO -2.34,10.7; GND -3.44,10.9; RSV1 -8.94,10.7; RSV2 -1.24,10.7; SCLK -4.54,10.7; VCC -5.64,10.9 | smd 1.4 x 1.9: GND1 -13.6,14.55; GND3 -0.45,13.55
SMT-JUMPER_2_NO_NO-SILK = smd 0.635 x 1.27: 1 -0.406,0; 2 0.406,0
R0805 = smd 1.3 x 1.5: 1 -0.95,0; 2 0.95,0
TACTILE_SWITCH_TALL = smd 1.55 x 1.3: A1 -3.975,-2.25; A2 3.975,-2.25; B1 -3.975,2.25; B2 3.975,2.25
SOT360-1_NXP = smd 1.473 x 0.356: 1 -2.921,2.925; 2 -2.921,2.275; 3 -2.921,1.625; 4 -2.921,0.975; 5 -2.921,0.325; 6 -2.921,-0.325; 7 -2.921,-0.975; 8 -2.921,-1.625; 9 -2.921,-2.275; 10 -2.921,-2.925; 11 2.921,-2.925; 12 2.921,-2.275; 13 2.921,-1.625; 14 2.921,-0.975; 15 2.921,-0.325; 16 2.921,0.325; 17 2.921,0.975; 18 2.921,1.625; 19 2.921,2.275; 20 2.921,2.925
PW14 = smd 1.676 x 0.356: 1 -2.819,1.95; 2 -2.819,1.3; 3 -2.819,0.65; 4 -2.819,0; 5 -2.819,-0.65; 6 -2.819,-1.3; 7 -2.819,-1.95; 8 2.819,-1.95; 9 2.819,-1.3; 10 2.819,-0.65; 11 2.819,0; 12 2.819,0.65; 13 2.819,1.3; 14 2.819,1.95
SON_B1-APUR_STM = smd 0.813 x 0.254: 1 -1.473,1; 2 -1.473,0.5; 3 -1.473,0; 4 -1.473,-0.5; 5 -1.473,-1; 6 1.473,-1; 7 1.473,-0.5; 8 1.473,0; 9 1.473,0.5; 10 1.473,1 | smd 1.753 x 2.489: 11 0,0
SOT-23-5_MC_MCH = smd 1.321 x 0.508: 1 -1.295,0.95; 2 -1.295,0; 3 -1.295,-0.95; 4 1.295,-0.95; 5 1.295,0.95
PQFN50P300X300X100-16N = smd 0.53 x 0.35: 1 -1.22,1; 2 -1.22,0.5; 3 -1.22,0; 4 -1.22,-0.5; 5 -1.22,-1; 9 1.22,-1; 10 1.22,-0.5; 11 1.22,0; 12 1.22,0.5; 13 1.22,1 | smd 0.35 x 0.53: 6 -0.5,-1.22; 7 0,-1.22; 8 0.5,-1.22; 14 0.5,1.22; 15 0,1.22; 16 -0.5,1.22
IND_4028_TDK = smd 1.6 x 3.9: 1 -1.45,0; 2 1.45,0
ECX-32 = smd 1.3 x 1.1: 1 -1.15,-0.9; 2 1.15,-0.9; 3 1.15,0.9; 4 -1.15,0.9

### Placement (x,y rotation side)
C1  29.84,38.86 90 bottom
C2  46.23,27.81 225 bottom
C3  43.69,30.35 315 bottom
C4  39.88,26.54 315 bottom
C5  42.42,24 225 bottom
C6  44.96,25.27 225 bottom
C7  31.75,4.45 0 top
C8  29.59,8.26 90 bottom
C9  22.48,7.75 270 top
C10  22.35,2.79 90 top
C11  53.47,24.51 45 top
C12  48.39,1.4 180 top
C13  44.32,2.79 270 top
C14  30pF  [C0805']  36.32,15.62 180 top
C15  30pF  [C0805']  33.02,19.56 270 top
D1  66.93,14.73 270 top
D2  66.93,12.83 270 top
D3  66.93,10.92 270 top
D4  66.93,9.02 270 top
D5  66.93,7.11 270 top
D6  66.93,5.21 270 top
D7  66.93,3.3 270 top
D8  66.93,1.4 270 top
D9  31.75,2.29 270 top
H1  4.06,39.88 0 bottom
H2  87.12,39.88 0 bottom
H3  4.06,4.06 0 bottom
H4  87.12,4.06 0 bottom
IC1  43.69,26.54 225 top
J1  59.94,36.2 0 top
J2  1.52,24.13 90 top
J4  67.82,41.27 0 top
J5  8.89,24.13 90 top
J6  1.52,10.16 90 top
J7  8.89,10.16 90 top
J8  90.04,24.26 90 top
J9  82.42,24.26 90 top
J10  90.04,10.29 90 top
J11  82.42,10.29 90 top
J12  47.88,41.4 180 top
J13  74.4,23.98 180 top
J14  51.82,41.27 0 top
J15  38.73,1.52 90 top
J16  25.4,6.35 90 top
J17  31.75,2.54 90 bottom
J18  60.36,27.49 0 top
J19  12.7,1.52 90 top
J20  55.63,14.86 270 top
J21  58.8,9.27 270 top
J22  69.36,27.49 0 top
J23  60.36,30.96 0 top
J24  69.36,30.96 0 top
J25  60.36,24.01 0 top
J26  26.29,28.19 0 top
JP1  20.57,35.69 180 bottom
JP2  18.92,37.21 180 bottom
JP3  20.57,38.73 180 bottom
JP4  18.92,40.13 180 bottom
JP5  20.57,41.66 180 bottom
R1  31.75,33.91 90 bottom
R2  33.66,38.73 270 bottom
R3  18.03,30.48 270 bottom
R4  18.03,26.42 90 bottom
R5  20.32,30.48 270 bottom
R6  20.32,26.42 90 bottom
R7  22.61,30.48 270 bottom
R8  22.61,26.42 90 bottom
R9  72.77,4.06 90 top
R10  72.77,8.26 270 top
R11  75.31,4.06 90 top
R12  75.31,8.26 270 top
R13  77.85,4.06 90 top
R14  77.85,8.26 270 top
R15  44.7,7.49 270 bottom
R16  44.7,3.43 90 bottom
R17  62.36,18.54 0 bottom
R18  62.36,16.13 0 bottom
R19  62.36,13.72 0 bottom
R20  62.36,11.3 0 bottom
R21  62.36,8.89 0 bottom
R22  62.36,6.48 0 bottom
R23  62.36,4.06 0 bottom
R24  62.36,1.65 0 bottom
R27  77.22,36.07 270 top
R28  74.68,36.07 270 top
R29  5.08,31.75 0 bottom
R30  5.08,34.29 0 bottom
R31  12.57,31.62 0 bottom
R32  12.7,34.29 0 bottom
R33  5.08,17.78 0 bottom
R34  5.08,20.32 0 bottom
R35  12.7,17.78 0 bottom
R36  12.7,20.32 0 bottom
R37  86.23,31.88 180 bottom
R38  86.23,34.42 180 bottom
R39  78.61,31.88 180 bottom
R40  78.61,34.42 180 bottom
R41  86.23,17.91 180 bottom
R42  86.23,20.45 180 bottom
R43  78.61,17.91 180 bottom
R44  78.61,20.45 180 bottom
R45  35.05,3.43 90 top
R46  35.94,7.87 270 top
R47  37.97,8.26 90 bottom
R48  33.15,8.26 90 bottom
R49  19.05,1.65 0 top
R50  19.05,3.81 180 top
R57  17.91,3.43 90 bottom
R58  17.91,7.49 270 bottom
R59  20.19,3.43 90 bottom
R60  20.19,7.49 270 bottom
R61  5.08,29.21 0 bottom
R62  12.7,29.21 0 bottom
R63  5.08,15.24 0 bottom
R64  12.7,15.24 0 bottom
R65  86.23,29.34 180 bottom
R66  78.61,29.34 180 bottom
R67  86.23,15.37 180 bottom
R68  78.61,15.37 180 bottom
R69  47.88,8.51 0 bottom
R70  31.75,15.88 315 top
S1  31.75,36.45 270 top
U1  20.57,19.18 180 bottom
U2  75.31,15.62 0 top
U3  19.68,38.61 180 bottom
U4  19.05,7.62 180 top
U5  31.75,7.62 270 top
U8  48.01,5.71 180 top
U$1  13.59,9.02 90 top
U$3  36.32,19.56 90 top

### Tracks (layer width: path | path; a pad name or v marks a point on that pad's centre or on a via)
!MCLR  (via drill 0.3)
  Top 0.127: IC1.7 48.5,30.25 48.75,30.5 v48.75,33 48.75,40.5 48,41.25 J12.1
  Bottom 0.127: v48.75,33 31.75,33 R1.1
!MUX1_INT0  (via drill 0.3)
  Top 0.127: v16.5,18.25 9.25,25.5 2.75,25.5 2.75,27.5 1.75,28.5 1.75,29 J2.3
  Bottom 0.127: v16.5,18.25 17.5,18.25 U1.4 | R61.2 4,29.25 1.75,29.25 J2.3
!MUX1_INT1  (via drill 0.3)
  Top 0.127: v18.75,20.25 17,22 17,28.5 9.5,36 7.25,36 7.25,30.75 8.75,29.25 J5.3
  Bottom 0.127: v18.75,20.25 17.75,20.25 U1.7 | R62.2 11.75,29.25 9,29.25 J5.3
!MUX1_INT2
  Bottom 0.127: U1.11 23.5,22 24.25,22 26.5,19.75 26.5,13.75 9.5,13.75 9.25,14 5.25,14 4.25,15 R63.2 4,15.25 1.75,15.25 J6.3
!MUX1_INT3
  Bottom 0.127: U1.14 23.5,20 24.25,20 26,18.25 26,14.25 12.5,14.25 11.75,15 R64.2 9,15.25 J7.3
!MUX2_INT0  (via drill 0.3)
  Top 0.127: v74.5,21.75 74.5,16.75 72.5,16.75 U2.4 | v84.25,22.5 88.75,27 88.75,28 90,29.25 J8.3
  Bottom 0.127: v74.5,21.75 75.25,22.5 v84.25,22.5 | R65.2 87.25,29.25 90,29.25 J8.3
!MUX2_INT1  (via drill 0.3)
  Top 0.127: v75.5,14.5 72.5,14.5 U2.7 | v81,15 81.25,15.25 81.25,28.25 82.25,29.25 J9.3
  Bottom 0.127: v75.5,14.5 76.25,13.75 79.25,13.75 79.75,14.25 80.25,14.25 v81,15 | R66.2 79.75,29.25 82.25,29.25 J9.3
!MUX2_INT2  (via drill 0.3)
  Top 0.127: v80.75,10.25 78.25,12.75 U2.11
  Bottom 0.127: v80.75,10.25 82,9 90.5,9 91.25,9.75 91.25,15.25 90.25,15.25 J10.3 90,15.5 87.25,15.5 R67.2
!MUX2_INT3  (via drill 0.3)
  Top 0.127: U2.14 78.25,14.5 82.25,14.5 82.25,15.25 J11.3 | v50,17 50,16.5 45.75,12.25 45.75,5.75 46.75,5.75 U8.11
  Bottom 0.127: v50,17 50.25,17.25 64,17.25 66.25,15 76.25,15 77,14.25 78.5,14.25 79.5,15.25 R68.2 79.75,15.5 82.25,15.5 J11.3
!RGB1_EN
  Top 0.127: IC1.4 49.5,29.25 53.25,33 59,33 59,25.5 60.25,24.25 J25.1
!RGB2_EN  (via drill 0.3)
  Top 0.127: v48.5,25.75 48.5,29 48.75,29.25 IC1.5
  Bottom 0.127: v48.5,25.75 48.75,25.5 61.25,25.5 62.75,24 J25.2
!RGB3_EN
  Top 0.127: IC1.6 48.75,29.75 52.5,33.5 64.25,33.5 64.25,25.25 65.25,24.25 J25.3
!SS  (via drill 0.3)
  Top 0.127: IC1.15 45.5,33 46,33.5 v46,34 46,37.75 v47.5,39.25
  Bottom 0.127: JP1.2 21,35.75 21,37 21.5,37 21.75,37.25 22.5,37.25 U3.13 22.75,37.25 23.25,37.25 26.5,34 v46,34 | v47.5,39.25 69,39.25 69,41.75 69.75,42.5 71.75,42.5 72.75,41.5 J4.3
!U1RTS  (via drill 0.3)
  Top 0.127: v39.5,32.25 39.5,31.75 40,31.25 IC1.23 | v62.5,34.5 63.75,35.75 63.75,40.5 64.5,41.25 J14.6
  Bottom 0.127: v39.5,32.25 39.75,32.5 57.25,32.5 59.25,34.5 v62.5,34.5
+3V3  (via drill 0.3)
  Top 0.127: R9.1 73,3.25 75.25,3.25 R11.1 75.5,3.25 77.75,3.25 R13.1 78,3.25 82.25,7.5 82.25,10.25 J11.1 82.5,10.5 83.75,11.75 v83.75,22 82.5,23.25 82.5,24.25 J9.1 | v78,19.25 78,18.5 U2.20 | J1.1 60,36.25 63.25,39.5 63.25,41.75 64,42.5 67.75,42.5 67.75,41.5 J4.1 68,41.25 68.75,41.25 72.75,37.25 74.5,37.25 R28.1 74.75,37.25 77,37.25 R27.1 77.25,37 v78.25,36 | J12.2 45.5,41.5 47.25,43.25 56.75,43.25 56.75,41.5 J14.3 | 21.25,3 21.25,4.25 20.75,4.75 20.75,6.5 U4.1 | 21.25,3 22.25,2 C10.1 | 21.25,3 20,1.75 R49.2 20,1.5 19,0.5 14,0.5 14,2.75 12.75,4 J19.2 12.5,4.25 9,7.75 9,10 J7.1 | v22,36 21,37 21,38.75 20.75,39 J26.VCC | IC1.38 38.75,23.5 39.75,24.5 v39.75,29 39.75,29.5 39.25,30 IC1.26 39,30.25 38.5,30.75 v38.5,36.5 39.25,36.5 40,35.75 40,34.25 41.5,32.75 IC1.19 | IC1.10 47,31 46.75,30.75 v46.75,29 46.75,23.75 47.75,22.75 IC1.57 | U8.14 U8.15 48,4.25 49.25,3 | 49.25,3 49.25,1.5 C12.1 | 49.25,3 49.25,4.75 U8.1 | U8.14 v47,4 44.5,1.5 C13.+ | U8.14
  Bottom 0.127: J10.1 90,10.25 82.5,10.25 J11.1 | 85.25,16.75 85.25,17.75 R41.1 85.25,18 85.25,20.25 R42.1 85.25,20.5 v83.75,22 | 85.25,16.75 85.25,15.5 R67.1 | R44.1 77.75,20.25 78,20.25 v78,19.25 78,18 77.75,18 R43.1 77.75,17.75 77.75,16.75 | 77.75,16.75 77.75,15.5 R68.1 | 77.75,16.75 85.25,16.75 | R38.1 85.25,34.25 85.25,32 R37.1 85.25,31.75 85.25,29.5 R65.1 85.25,29.25 84,28 79,28 | 80.75,26.25 82.5,24.5 J9.1 82.5,24.25 90,24.25 J8.1 | 80.75,26.25 79,28 | 79,28 R66.1 77.75,29.5 77.75,31.75 R39.1 77.75,32 77.75,34.25 R40.1 77.75,34.5 77.75,36 v78.25,36 | 80.75,26.25 74,26.25 72,24.25 J13.2 | 38.5,39.75 43.5,39.75 45,41.25 45.25,41.25 J12.2 | 38.5,39.75 33.75,39.75 R2.1 | J14.3 57,41.5 58,42.5 66.75,42.5 67.75,41.5 J4.1 | 13.75,19 13.75,20.25 R36.1 | 13.75,19 13.75,18 R35.1 13.75,17.75 13.75,15.25 | 13.75,15.25 22.25,15.25 23.25,16.25 U1.20 | 13.75,15.25 R64.1 | R63.1 6,15.25 6,17.75 R33.1 6,18 6,19 | 6,19 6,20.25 R34.1 6,20.5 3.25,23.25 | 3.25,23.25 2.5,24 1.75,24 J2.1 | 3.25,23.25 8,23.25 8.75,24 J5.1 9,24.25 41,24.25 | 6,19 13.75,19 | J6.1 1.75,10.25 8.75,10.25 J7.1 9,10.25 10.75,12 41,12 | U3.14 22.5,36.5 v22,36 22,31.5 | 22,31.5 20.5,31.5 R5.1 20.25,31.5 18.25,31.5 R3.1 18,31.5 13.75,31.5 | 22,31.5 22.5,31.5 R7.1 | 22,31.5 R7.1 | 6,31.75 6,30.5 | 6,30.5 6,29.25 R61.1 | 6,31.75 6,34.25 R30.1 | 6,31.75 R29.1 | 13.75,31.5 13.75,30.5 | 13.75,30.5 13.75,29.25 R62.1 | U3.1 16.75,36.5 14.75,34.5 13.75,34.5 R32.1 13.75,34.25 13.75,31.75 R31.1 13.75,31.5 | 13.75,30.5 6,30.5 | 42.5,25.5 42.75,25.75 43,25.75 | 42.5,25.5 41.75,24.75 C5.1 41.5,24.5 41,24.5 41,24.25 | 43,25.75 44.25,25.75 C6.1 | 42.5,25.5 42.25,25.5 40.75,27 C4.1 40.5,27.25 38.75,27.25 38.75,28.25
  Bottom 0.127: 43,25.75 45.5,28.25 C2.1 45.75,28.5 46.25,28.5 v46.75,29 | 38.75,28.25 39.5,29 | 39.5,29 41.75,31.25 44.25,31.25 C3.1 | 41,12 44.5,8.5 R15.1 44.75,8.5 46.75,8.5 R69.2 47,8.5 v47,4 | 41,24.25 41,12 | 39.5,29 v39.75,29 | 38.75,28.25 25.75,28.25 22.75,31.25 R7.1 | v38.5,36.5 38.5,39.75
ACCEL_A0  (via drill 0.3)
  Top 0.127: v46.25,7.25 46.25,7.5 47.75,7.5 48,7.25 48,7 U8.7
  Bottom 0.127: v46.25,7.25 45.75,6.75 44.75,6.75 R15.2 44.75,6.5 44.75,4.5 R16.2
BB_EN  (via drill 0.3)
  Top 0.127: v16.75,8.75 16.75,8.5 17.5,8.5 U4.6
  Bottom 0.127: v16.75,8.75 16.25,8.25 16.25,6.75 17.75,6.75 R58.2 18,6.5 18,4.5 R57.2
BB_M/S  (via drill 0.3)
  Top 0.127: v16.75,8 17.5,8 U4.7
  Bottom 0.127: v16.75,8 16.75,7.5 19.25,7.5 20,6.75 R60.2 20.25,6.5 20.25,4.5 R59.2
CD  (via drill 0.3)
  Top 0.127: v44,42.5 44,34.75 45.25,33.5 IC1.16
  Bottom 0.127: U3.9 22.5,40 21.75,40 21.5,40.25 21,40.25 21,41.5 JP5.2 21,41.75 28,41.75 29,42.75 43.75,42.75 v44,42.5
GND  (via drill 0.3)
  Top 0.127: 68,2.25 68,3.25 D7.C 68,3.5 68,5 D6.C 68,5.25 68,7 D5.C 68,7.25 68,9 D4.C 68,9.25 68,10.75 D3.C 68,11 68,12.75 D2.C 68,13 68,14.5 D1.C 67.75,14.75 67.75,17.25 | 68,2.25 68,1.5 D8.C | 55,25 59,25 59,19.75 60.75,18 67.75,18 67.75,17.25 | 55,25 54,25 C11.2 | 67.75,17.25 74.25,23.75 J13.1 | U2.10 72.5,12.75 72.75,12.5 72.75,9.25 R10.1 73,9.25 75.25,9.25 R12.1 75.5,9.25 77.75,9.25 R14.1 78,9.25 81.25,9.25 81.25,11.75 82.25,12.75 J11.2 | J9.2 82.5,27 87,31.5 87,39.75 H2.B3,0 | J8.2 90.25,26.75 91.25,25.75 91.25,14 90.25,13 J10.2 90,12.75 87.25,10 87.25,4.25 H4.B3,0 87,4 87,2.25 68,2.25 | IC1.9 47.75,31 48.25,31.5 48.25,39.25 46.5,41 46.5,41.75 47.5,42.75 51.75,42.75 51.75,41.5 J14.1 | J26.GND 23,39 23.25,38.75 23.25,38 23.5,37.75 25.75,37.75 v25.75,40 25.75,41.5 J26.GND3 25.75,41.75 12.75,41.75 12.75,42.5 J26.GND1 12.5,42.5 4.25,42.5 4.25,40 H1.B3,0 | v13,22.5 9,26.5 J5.2 | v29.5,25.5 S1.A2 29.5,36.25 v28.75,37 | v42,30.75 42,31.25 41.25,32 IC1.20 | 40.5,23.25 40.5,23 40,22.5 IC1.41 39.75,22.25 38.5,21 38.5,15.25 35.5,12.25 | 40.5,23.25 v40.5,25.5 v40.5,29.25 39.5,30.25 IC1.25 | 40.5,23.25 v41.5,23.25 | 32.25,8 32.25,4.75 32.5,4.5 C7.2 | 32.25,8 32.25,8.25 31.75,8.75 U5.2 v31.75,10 | U$3.4 35.25,18.5 33.25,18.5 C15.2 | U$3.2 37,20.5 35.5,19 35.5,18.5 U$3.4 | 35.5,12.25 35.5,15.5 C14.2 35.5,15.75 35.5,18.25 U$3.4 | 35.5,12.25 35.5,9.25 35.75,9 R46.1 35.75,8.75 35.75,8 | 35.75,8 32.25,8 | 4.25,12.75 8.75,12.75 J7.2 | 4.25,12.75 1.75,12.75 J6.2 | 4.25,12.75 4.25,4.25 H3.B3,0 | 19,7 17.75,7 U4.9 | 19,7 19,7.5 U4.11 | U4.11 19.25,7.5 20.5,7.5 U4.3 20.75,7.5 22.25,7.5 22.25,7 C9.2
  Top 0.127: 19,7 19,5 20,4 R50.1 | 19,7 U4.11 | 22.5,6.25 22.5,6.75 C9.2 | 22.5,6.25 22.5,3.75 C10.2 | 22.5,6.25 25.25,6.25 J16.1 | 22.5,6.25 C9.2 | v50,6.75 49.25,6.75 U8.5 | 47,5.25 47,4.75 U8.13 46.75,4.75 44.5,4.75 44.5,4.25 C13.- 44.25,4 43.25,3 43.25,0.5 | 47.25,6 48.5,4.75 U8.16 | 47.25,6 47,6.25 U8.10 | 47,5.25 47.25,5.25 47.25,6 | 47,5.25 U8.12 | 40,0.5 38.75,0.5 38.75,1.5 J15.1 | 40,0.5 43.25,0.5 | 43.25,0.5 45.25,0.5 45.5,0.75 45.5,1.25 47.25,1.25 C12.2 | 35.75,8 40,8 40,0.5 | v55,24.75 55,25
  Bottom 0.127: J11.2 82.5,13 90,13 J10.2 | 70.25,40 69,38.75 65,38.75 62.5,36.25 J1.2 | 70.25,40 70.25,41.25 J4.2 | J9.2 82.5,27 90,27 J8.2 | 70.25,40 87,40 H2.B3,0 | J14.1 51.75,41.5 50.5,42.75 45,42.75 44.25,42 43.5,42 43,41.5 J12.3 42.75,41.25 41.75,40.25 37.25,40.25 36.75,40.75 30.75,40.75 30,40 C1.2 29.75,40 28.75,40 | U3.7 16.75,40.5 4.75,40.5 4.25,40 H1.B3,0 | v25.75,40 28.75,40 | v13,22.5 17.25,22.5 17.5,22.25 U1.10 | J2.2 1.75,26.75 8.75,26.75 J5.2 9,26.5 10,25.5 18,25.5 R4.1 18.25,25.5 20.25,25.5 R6.1 20.5,25.5 22.5,25.5 R8.1 22.75,25.5 | 22.75,25.5 v29.5,25.5 | v29.5,25.5 38.75,25.5 39,25.75 C4.2 39.25,25.75 39.5,25.5 v40.5,25.5 | 46.75,24.75 46.75,27 C2.2 | 46.75,24.75 45.75,24.75 C6.2 45.5,24.5 44.25,24.5 43.25,23.5 C5.2 43,23.25 v41.5,23.25 | C3.2 43,29.75 v42,30.75 v40.5,29.25 | v31.75,10 30.5,10 29.75,9.25 C8.2 | 10.5,3.75 10.25,4 4.25,4 H3.B3,0 | 10.5,3.75 12.5,1.75 J19.1 | 34.25,2.75 34.25,4.75 J17.P2 | 34.25,2.75 34.5,2.75 J17.P3 | J17.5 30.25,5 29.5,5 J17.P1 | 29.25,2.75 29.25,4.75 J17.P1 | 29.25,2.75 29,2.75 J17.P4 29.25,2.75 | 29.25,2.75 30.75,2.75 J17.P6 31,2.5 32.5,2.5 J17.P5 32.75,2.75 34.25,2.75 | 34.25,2.75 J17.P3 | v50,6.75 50,2.5 44.75,2.5 R16.1 44.5,2.25 44,1.75 38.75,1.75 J15.1 38.5,1.75 35.5,1.75 34.75,2.5 J17.P3 | J17.P1 29.25,5 26.75,5 J16.1 25.25,6.5 22,6.5 20.25,8.25 R60.1 20,8.5 18,8.5 R58.1 17.75,8.5 17,9.25 16,9.25 10.5,3.75 | v28.75,37 28.75,40 | 46.75,24.75 v55,24.75 | 22.75,25.5 v29.5,25.5
  other vias: 30.77,26.77 28.23,26.77 29.5,26.77 30.77,25.5 32.04,25.5 33.31,25.5 32.04,26.77 33.31,26.77 26.96,26.77 28.23,25.5 26.96,25.5 25.69,26.77 25.69,25.5 24.42,26.77 24.42,25.5 30.77,29.31 32.04,29.31 30.77,30.58 29.5,30.58 29.5,29.31 28.23,29.31 28.23,30.58 28.23,31.85 28.23,33.12 26.96,29.31 23.15,35.66 23.15,34.39 24.42,34.39 24.42,33.12 25.69,31.85 25.69,33.12 9.18,39.47 9.18,38.2 10.45,38.2 10.45,36.93 11.72,36.93 11.72,38.2 11.72,39.47 10.45,39.47 12.99,39.47 12.99,38.2 12.99,36.93 14.26,36.93 14.26,38.2 14.26,39.47 5.37,26.77 6.64,26.77 29.5,19.15 29.5,17.88 30.77,20.42 30.77,19.15 33.31,16.61 38.39,14.07 25.69,22.96 25.69,21.69 28.23,12.8 29.5,12.8 28.23,14.07 42.2,6.45 40.93,7.72 42.2,8.99 40.93,10.26 42.2,14.07 81.57,5.18 80.3,6.45 81.57,7.72 80.3,7.72 80.3,8.99 86.65,11.53 86.65,12.8 85.38,11.53 85.38,25.5 86.65,26.77 85.38,26.77 84.11,26.77 80.3,38.2 81.57,38.2 81.57,36.93 80.3,36.93 79.03,38.2 47.28,36.93 44.74,36.93 42.2,36.93
  pour Top: 4.06,4.06 4.06,39.88 87.12,39.88 87.12,4.06
  pour Bottom: 4.06,4.06 4.06,39.88 87.12,39.88 87.12,4.06
I2C_MUX1_A0  (via drill 0.3)
  Top 0.127: v16.25,16.5 19.25,19.5 v19.25,26.5
  Bottom 0.127: v16.25,16.5 17.25,16.5 17.5,16.25 U1.1 | v19.25,26.5 18.5,27.25 18.25,27.25 R4.2 18.25,27.5 18.25,29.5 R3.2
I2C_MUX1_A1  (via drill 0.3)
  Top 0.127: v19,17 21.5,19.5 v21.5,26.25
  Bottom 0.127: v19,17 17.75,17 U1.2 | v21.5,26.25 20.5,27.25 R6.2 20.5,27.5 20.5,29.5 R5.2
I2C_MUX1_A2  (via drill 0.3)
  Top 0.127: v19,17.75 21,19.75 v21,28.5
  Bottom 0.127: v19,17.75 18,17.75 17.75,17.5 U1.3 | 21.25,28.75 22,29.5 22.5,29.5 R7.2 | 21.25,28.75 v21,28.5 | 21.25,28.75 22.5,27.5 R8.2
I2C_MUX2_A0
  Top 0.127: 71.75,6.25 72.75,5.25 R9.2 | 71.75,6.25 70.75,7.25 70.75,18.5 72.25,18.5 U2.1 | 71.75,6.25 72.75,7.25 R10.2
I2C_MUX2_A1
  Top 0.127: U2.2 72.5,18 73.5,18 73.5,18.75 73.25,19 70.25,19 70.25,5.75 72,4 75.25,4 75.25,5 R11.2 75.5,5.25 75.5,7.25 R12.2
I2C_MUX2_A2
  Top 0.127: U2.3 72.25,17.25 71.25,17.25 71.25,9 72,8.25 77.75,8.25 77.75,7.5 R14.2 78,7.25 78,5.25 R13.2
LED1  (via drill 0.3)
  Top 0.127: v43.75,15 39.5,19.25 39.5,21.25 40,21.75 IC1.42 | v57,17.75 55.75,16.5 55.75,15 J20.1
  Bottom 0.127: v43.75,15 55.5,15 J20.1 | v57,17.75 60.5,17.75 61.25,18.5 R17.2
LED2  (via drill 0.3)
  Top 0.127: v45.25,14.25 40,19.5 40,21 40.5,21.5 IC1.43
  Bottom 0.127: J20.2 55.5,12.5 53.75,14.25 v45.25,14.25 43.25,14.25 43.25,15.25 44.5,16.5 61,16.5 61.25,16.25 R18.2
LED3  (via drill 0.3)
  Top 0.127: v46.5,13.75 44.25,16 44.25,21.75 41.5,21.75 41,21.25 IC1.44
  Bottom 0.127: v46.5,13.75 50.25,10 51.25,10 | 51.25,10 55.5,10 J20.3 | 51.25,10 55.75,5.5 62.25,5.5 62.25,7.25 62.5,7.5 67.5,7.5 67.5,11.25 64,14.75 62.5,14.75 61.5,13.75 R19.2
LED4  (via drill 0.3)
  Top 0.127: v47,16 47,18 45.25,19.75 IC1.49
  Bottom 0.127: v47,16 56.75,16 61.25,11.5 R20.2 61.5,11.25 62.25,11.25 62.25,8 62,7.75 60.75,7.75 60.5,8 56.5,8 55.75,7.25 J20.4
LED5  (via drill 0.3)
  Top 0.127: v51.75,13.75 51.75,16 46.75,21 IC1.53
  Bottom 0.127: v51.75,13.75 54.5,11 57.25,11 58.75,9.5 J21.1 59,9.25 61,9.25 61.25,9 R21.2
LED6  (via drill 0.3)
  Top 0.127: v46.25,22.75 46.25,22.25 46.75,21.75 IC1.54 | v53,22.5 57.5,18 57.5,8 58.75,6.75 J21.2
  Bottom 0.127: v46.25,22.75 46.5,22.5 v53,22.5 | R22.2 61.25,6.5 59,6.5 J21.2
LED7
  Top 0.127: IC1.58 48.5,23 53.75,17.75 53.75,5 58.25,0.5 60,0.5 60,3 59,4 J21.3
  Bottom 0.127: R23.2 61.25,4 59,4 J21.3
LED8
  Top 0.127: IC1.59 48.75,23.25 54.25,17.75 54.25,6.25 58.75,1.75 J21.4
  Bottom 0.127: R24.2 61.25,1.75 59,1.75 J21.4
MISO  (via drill 0.3)
  Top 0.127: IC1.34 37.25,24.75 36.75,24.25 27.75,24.25 v27.75,39.25 27.75,43.75 78.25,43.75 80.5,41.5 J4.6
  Bottom 0.127: JP4.2 19.5,40 19.75,39.75 21.25,39.75 21.75,39.25 U3.10 22.75,39.25 v27.75,39.25
MOSI  (via drill 0.3)
  Top 0.127: IC1.33 37,25.25 30.5,31.75 v30.5,34.5 31.5,35.5 31.5,39.75 v35,43.25
  Bottom 0.127: JP3.2 21,38.75 22.5,38.75 U3.11 22.75,38.5 26.5,38.5 v30.5,34.5 | v35,43.25 35.5,43.75 75.5,43.75 77.75,41.5 J4.5
MUX1_SC0  (via drill 0.3)
  Top 0.127: v14.25,22 10.25,26 10.25,27 9.25,28 2.75,28 2.75,33.25 1.75,34.25 J2.5
  Bottom 0.127: v14.25,22 16.5,19.75 17.25,19.75 17.5,19.5 U1.6 | R30.2 4,34.25 1.75,34.25 J2.5
MUX1_SC1  (via drill 0.3)
  Top 0.127: v16,21.5 15.25,22.25 15.25,28 9,34.25 J5.5
  Bottom 0.127: v16,21.5 17.5,21.5 U1.9 | R32.2 11.75,34.25 9,34.25 J5.5
MUX1_SC2  (via drill 0.3)
  Top 0.127: v4.5,22.75 1.75,22.75 1.75,20.5 J6.5
  Bottom 0.127: v4.5,22.75 9.25,22.75 9.5,23 18,23 20,21 23,21 23.25,20.75 U1.13 | R34.2 4,20.25 1.75,20.25 J6.5
MUX1_SC3
  Bottom 0.127: 11.75,20.5 12.75,21.5 14.25,21.5 14.5,21.25 14.5,17.5 16.25,15.75 18.5,15.75 21.5,18.75 23.25,18.75 U1.16 | 11.75,20.5 9,20.5 J7.5 | 11.75,20.5 R36.2
MUX1_SD0  (via drill 0.3)
  Top 0.127: v16.5,19 14.75,20.75 v14.75,26
  Bottom 0.127: v16.5,19 17.5,19 U1.5 | v14.75,26 12.75,28 5.5,28 5,28.5 5,31.75 R29.2 J2.4
MUX1_SD1  (via drill 0.3)
  Top 0.127: v16.5,21 16.5,28.5 9.5,35.5 7.75,35.5 7.75,32.75 8.75,31.75 J5.4
  Bottom 0.127: v16.5,21 17.25,21 17.5,20.75 U1.8 | J5.4 11.5,31.75 R31.2
MUX1_SD2  (via drill 0.3)
  Top 0.127: v10.25,23.5 4.75,18 1.75,18 J6.4
  Bottom 0.127: v10.25,23.5 18,23.5 20,21.5 23.25,21.5 U1.12 | R33.2 4,17.75 1.75,17.75 J6.4
MUX1_SD3  (via drill 0.3)
  Top 0.127: v19.75,19.25 16.5,16 9.75,16 9.75,17 9,17.75 J7.4
  Bottom 0.127: v19.75,19.25 23,19.25 23.25,19.5 U1.15 | R35.2 11.75,17.75 9,17.75 J7.4
MUX2_SC0  (via drill 0.3)
  Top 0.127: v82,35.75 77.75,31.5 77.75,24.25 75.5,22 75.5,15.25 72.5,15.25 U2.6
  Bottom 0.127: v82,35.75 85.75,35.75 87,34.5 R38.2 87.25,34.5 90,34.5 J8.5
MUX2_SC1
  Top 0.127: U2.9 72.5,13.5 76.5,13.5 76.5,21.5 78.75,23.75 78.75,30.75 82.25,34.25 J9.5
  Bottom 0.127: R40.2 79.75,34.5 82.25,34.5 J9.5
MUX2_SC2  (via drill 0.3)
  Top 0.127: v80.5,13 80.5,14 78.25,14 U2.13 | v84.25,11.5 88.75,16 88.75,19 90,20.25 J10.5
  Bottom 0.127: v80.5,13 82,11.5 v84.25,11.5 | R42.2 87.25,20.5 90,20.5 J10.5
MUX2_SC3  (via drill 0.3)
  Top 0.127: v49.75,21 52.25,18.5 52.25,6.25 49.25,6.25 U8.4 | v79.75,19.25 79.75,16 78.25,16 U2.16
  Bottom 0.127: v49.75,21 50,21.25 76.75,21.25 77,21.5 78.5,21.5 79.5,20.5 R44.2 | v79.75,19.25 79.75,20.25 R44.2 | J11.5 82.25,20.5 79.75,20.5 R44.2
MUX2_SD0  (via drill 0.3)
  Top 0.127: v75.75,23 75,22.25 75,16 72.5,16 U2.5
  Bottom 0.127: v75.75,23 90.5,23 91.25,23.75 91.25,31.75 90.25,31.75 J8.4 90,32 87.25,32 R37.2
MUX2_SD1  (via drill 0.3)
  Top 0.127: v78.25,30.5 78.25,24.25 76,22 76,14 72.5,14 U2.8
  Bottom 0.127: v78.25,30.5 79.5,31.75 R39.2 79.75,32 82.25,32 J9.4
MUX2_SD2  (via drill 0.3)
  Top 0.127: v80,13.5 78.25,13.5 U2.12
  Bottom 0.127: v80,13.5 80.5,14 85.75,14 86.25,14.5 86.25,17.75 87,17.75 R41.2 87.25,18 90,18 J10.4
MUX2_SD3  (via drill 0.3)
  Top 0.127: v50.5,9 48.5,7 U8.6 | v76.5,13 77.25,13.75 77.25,15 77.5,15.25 78,15.25 U2.15 78.25,15.25 79.5,15.25 80.25,16 80.25,16.75 v80.75,17.25
  Bottom 0.127: 80.75,18 82.25,18 J11.4 | 80.75,18 79.75,18 R43.2 | v50.5,9 56.5,3 66.5,3 v76.5,13 | v80.75,17.25 80.75,18
N$1  (via drill 0.3)
  Top 0.127: v33,34.5 33,33.5 34,32.5 S1.B2
  Bottom 0.127: 31.75,37.75 R1.2 31.75,34.75 32.75,34.75 v33,34.5 | 31.75,37.75 30,37.75 C1.1 | 31.75,37.75 33.5,37.75 R2.2
N$2  (via drill 0.3)
  Top 0.127: v47.75,6.25 47.5,6.5 47.5,6.75 U8.8
  Bottom 0.127: v47.75,6.25 47.75,7.5 48.75,8.5 R69.1
N$5  (via drill 0.3)
  Top 0.127: v64.5,17.5 64.5,16 65.75,14.75 D1.A
  Bottom 0.127: v64.5,17.5 63.5,18.5 R17.1
N$6
  Bottom 0.127: J17.2 32.25,5.25 32.25,6.5 32,6.75 32,8.25 36.75,8.25 37.5,7.5 37.75,7.5 R47.1
N$7  (via drill 0.3)
  Top 0.127: v64.5,15 64.5,14.25 65.75,13 D2.A
  Bottom 0.127: v64.5,15 63.5,16 R18.1
N$8
  Top 0.127: D9.C 33,2.25 35,2.25 R45.1
N$9
  Top 0.127: U4.10 17.75,6.5 18,6.25 18,4 R50.2 18,3.75 18,1.75 R49.1
N$10  (via drill 0.3)
  Top 0.127: v64.25,12.75 64.25,12.5 65.75,11 D3.A
  Bottom 0.127: v64.25,12.75 63.5,13.5 R19.1
N$11  (via drill 0.3)
  Top 0.127: v64.5,10.5 65.75,9.25 D4.A
  Bottom 0.127: v64.5,10.5 63.75,11.25 63.5,11.25 R20.1
N$12  (via drill 0.3)
  Top 0.127: v64.5,8.5 65.75,7.25 D5.A
  Bottom 0.127: v64.5,8.5 64.25,8.75 63.5,8.75 R21.1
N$13  (via drill 0.3)
  Top 0.127: v64.5,5.25 65.75,5.25 D6.A
  Bottom 0.127: v64.5,5.25 63.5,6.25 R22.1
N$14  (via drill 0.3)
  Top 0.127: v64.5,3.5 65.75,3.5 D7.A
  Bottom 0.127: v64.5,3.5 64,4 63.5,4 R23.1
N$15  (via drill 0.3)
  Top 0.127: v64.5,1.5 65.75,1.5 D8.A
  Bottom 0.127: v64.5,1.5 63.5,1.5 R24.1
N$16
  Top 0.127: U5.1 32.5,9 32.25,9.25 32.25,10.25 32,10.5 31.25,10.5 31.25,5.75 31.75,5.25 31.75,3.5 35,3.5 35,4.25 R45.2
N$17
  Bottom 0.127: J17.3 31.75,6.5 30.75,7.5 30.75,8.25 28.75,8.25 28.5,8.5 28.5,10.5 35,10.5 37.25,8.25 38.75,8.25 39,8 39,6.25 35.75,6.25 34.75,7.25 33.25,7.25 R48.1
N$18
  Top 0.127: U4.4 20.75,8 21.25,8.5 21.25,9 20,10.25 13.75,10.25 U$1.2
N$19
  Top 0.127: U5.5 32.75,6.5 35.75,6.5 35.75,6.75 R46.2
N$20  (via drill 0.3)
  Top 0.127: v21.25,5.25 21.25,7 20.75,7 U4.2 | v16.75,3.5 13.75,6.5 13.75,7.5 U$1.1
  Bottom 0.127: v21.25,5.25 21.25,3.5 v16.75,3.5
OSC1
  Top 0.127: R70.1 31.25,16.75 32,17.5 32,19.5 33,20.5 C15.1 33.25,20.5 35.25,20.5 U$3.3
  Top 0.152: U$3.3 36.56,21.84 37.93,21.84 IC1.39
OSC2  (via drill 0.3)
  Top 0.127: v34.25,15 32.5,15 R70.2 | v36.25,14.5 37,15.25 37,15.5 C14.1 37.25,15.75 37.25,18.25 U$3.1
  Top 0.152: IC1.40 38.23,21.44 38.23,19.41 U$3.1
  Bottom 0.127: v34.25,15 34.75,14.5 v36.25,14.5
PGEC1
  Top 0.127: IC1.17 42.25,33.25 41.5,34 41.5,42 40.75,42.75 37.75,42.75 37.75,41.5 J12.5
PGED1
  Top 0.127: IC1.18 41.75,33 40.5,34.25 40.5,41.25 J12.4
PWM1H  (via drill 0.3)
  Top 0.127: v52.75,31 50.25,28.5 IC1.2
  Bottom 0.127: v52.75,31 60.25,31 J23.1
PWM1L  (via drill 0.3)
  Top 0.127: v50.5,29.5 49.75,28.75 IC1.3
  Bottom 0.127: v50.5,29.5 52.25,27.75 60.25,27.75 J18.1
PWM2H  (via drill 0.3)
  Top 0.127: v53,29.75 49,25.75 49,25 49.5,24.5 IC1.62
  Bottom 0.127: v53,29.75 61.75,29.75 62.75,30.75 J23.2
PWM2L  (via drill 0.3)
  Top 0.127: v52.5,28.25 52,28.25 49.5,25.75 49.5,25.5 50,25 IC1.63
  Bottom 0.127: v52.5,28.25 53,28.75 61.5,28.75 62.75,27.5 J18.2
PWM3H  (via drill 0.3)
  Top 0.127: v58.5,31.5 51.25,24.25 51.25,23 49.5,23 49,23.5 IC1.60
  Bottom 0.127: v58.5,31.5 59,31.5 59.75,32.25 64.25,32.25 65.25,31.25 J23.3
PWM3L  (via drill 0.3)
  Top 0.127: v48,26.25 48,25.5 49.25,24.25 IC1.61
  Bottom 0.127: v48,26.25 62.25,26.25 62.5,26 63.75,26 65.25,27.5 J18.3
PWM4H  (via drill 0.3)
  Top 0.127: v58,32.5 50.5,25 IC1.64 | v68.25,33.25 69.25,32.25 69.25,31.25 J24.1
  Bottom 0.127: v58,32.5 58.75,33.25 v68.25,33.25
PWM4L  (via drill 0.3)
  Top 0.127: v51.75,29.25 50.5,28 IC1.1
  Bottom 0.127: v51.75,29.25 67.75,29.25 69.25,27.75 J22.1
PWM5H  (via drill 0.3)
  Top 0.127: v47.25,19.75 46.25,20.75 IC1.52 | v63,20 67.25,24.25 v67.25,29.75
  Bottom 0.127: v47.25,19.75 47.5,20 v63,20 | v67.25,29.75 70.75,29.75 71.75,30.75 J24.2
PWM5L  (via drill 0.3)
  Top 0.127: v48.5,20.5 47.25,21.75 IC1.55 | v70,20.5 73,23.5 73,26.25 72,27.25 J22.2
  Bottom 0.127: v70,20.5 v48.5,20.5
PWM6H  (via drill 0.3)
  Top 0.127: v45.5,27 44.75,26.25 44.75,20.75 45.25,20.25 IC1.50
  Bottom 0.127: v45.5,27 50.5,32 59,32 59.75,32.75 72.75,32.75 74.25,31.25 J24.3
PWM6L  (via drill 0.3)
  Top 0.127: v46.75,19.25 46.75,19.75 46,20.5 IC1.51 | v60.25,19.25 69.25,19.25 69.25,22 70.5,23.25 70.5,27.75 71.25,28.5 74.25,28.5 74.25,27.75 J22.3
  Bottom 0.127: v60.25,19.25 v46.75,19.25
RGB_DIN  (via drill 0.3)
  Top 0.127: v46.25,23.75 46.25,30.75 46.75,31.25 IC1.11
  Bottom 0.127: v46.25,23.75 47,23 62,23 62.25,22.75 68.25,22.75 69.25,23.75 J13.3
SCK  (via drill 0.3)
  Top 0.127: v20.5,36.75 22,35.25 22,23.75 37,23.75 37.5,24.25 IC1.35 37.75,24.5 38.25,25 38.25,25.25 35.5,28 35.5,41 v37.75,43.25
  Bottom 0.127: 20.5,37 19.5,37 JP2.2 | 20.5,37 21.5,38 22.5,38 U3.12 | 20.5,37 v20.5,36.75 | v37.75,43.25 73.5,43.25 75.25,41.5 J4.4
SCL1  (via drill 0.3)
  Top 0.127: v25.5,17 31.25,22.75 37.75,22.75 37.75,23 38.25,23.5 IC1.37 38.5,23.75 39.25,24.5 v39.25,27.75 | 78.75,36.25 82.25,36.25 83.75,34.75 83.75,33.25 82,33.25 79.25,30.5 79.25,17.25 78.25,17.25 U2.18 | 78.75,36.25 78.75,34.75 78.25,34.25 74.75,34.25 | 74.75,34.25 74.75,35 R28.2 | 74.75,34.25 73,36 70.25,36 J1.5 | v49.25,32 58.25,41 58.25,41.75 59.5,43 76.75,43 76.75,39.25 78.75,37.25 78.75,36.25
  Bottom 0.127: v25.5,17 25,17.5 23.5,17.5 U1.18 | v39.25,27.75 40,28.5 44.25,28.5 47.75,32 v49.25,32
SD_!SS  (via drill 0.3)
  Top 0.127: v18,36.25 18,38 18.25,38.25 J26.CS
  Bottom 0.127: 18,36.5 18.25,36.25 19.5,36.25 20,35.75 JP1.1 | 18,36.5 18,37.25 17,37.25 U3.2 | 18,36.5 v18,36.25
SD_CD  (via drill 0.3)
  Top 0.127: v27.25,42.25 27.25,31.75 24.25,28.75 J26.CD1
  Bottom 0.127: 19,41 18,41 18,40 17,40 U3.6 | 19,41 19.5,41 20,41.5 JP5.1 | v27.25,42.25 27,42.5 20.5,42.5 19,41
SD_MISO  (via drill 0.3)
  Top 0.127: v15.5,39.75 15.5,40.75 22.75,40.75 23.5,40 23.5,39.25 23.75,39 J26.DO
  Bottom 0.127: JP4.1 18.5,40 17.75,39.25 17,39.25 U3.5 16.75,39.25 16,39.25 v15.5,39.75
SD_MOSI  (via drill 0.3)
  Top 0.127: v20.25,37.5 20,37.75 20,38.5 19.75,38.75 J26.DI
  Bottom 0.127: U3.4 17,38.75 20,38.75 JP3.1 20.25,38.5 v20.25,37.5
SD_SCK  (via drill 0.3)
  Top 0.127: v15.5,38.5 16,39 16,40.25 21,40.25 21.25,40 21.25,39.25 21.5,39 J26.SCLK
  Bottom 0.127: JP2.1 18.5,37.25 17.75,38 17,38 U3.3 16.75,38 16,38 v15.5,38.5
SDA1  (via drill 0.3)
  Top 0.127: v24.75,17 31,23.25 37.5,23.25 37.5,23.5 38,24 IC1.36 38.25,24.25 38.75,24.75 38.75,25.5 36,28.25 v36,34.5 | v77,19.25 77,18 78,18 U2.19 | v68.75,20 67.75,21 67.75,36 J1.4 67.75,36.25 67.75,37.5 72,37.5 73.5,36 75.5,36 75.75,35.75 75.75,35.25 77,35.25 R27.2
  Bottom 0.127: v24.75,17 23.5,17 U1.19 | v77,19.25 76.25,20 v68.75,20 | v36,34.5 36.5,35 66.5,35 67.5,36 J1.4
U1CTS  (via drill 0.3)
  Top 0.127: v39,36 39,31.75 39.75,31 IC1.24 | v51.75,38.75 54.25,41.25 J14.2
  Bottom 0.127: v39,36 41.75,38.75 v51.75,38.75
U1RX  (via drill 0.3)
  Top 0.127: v43.5,39.25 43.5,30.25 41.75,30.25 40.75,31.25 IC1.22
  Bottom 0.127: v43.5,39.25 44.25,40 58,40 59.25,41.25 J14.4
U1TX  (via drill 0.3)
  Top 0.127: v39.5,35.5 39.5,33.25 40.75,32 IC1.21 | v58.75,38.25 61.75,41.25 J14.5
  Bottom 0.127: v39.5,35.5 42.25,38.25 v58.75,38.25
V_BATT
  Top 0.127: U5.3 30.75,9 25.5,9 J16.2
  Bottom 0.127: C8.1 29.5,7.5 29.25,7.75 26.5,7.75 25.5,8.75 J16.2
VBATT  (via drill 0.3)
  Top 0.127: 16.75,7.5 16.25,7.5 16.25,9 | 16.75,7.5 17.5,7.5 U4.8 | 16.25,9 16.5,9.25 20.5,9.25 20.5,8.5 U4.5 | 16.25,9 12,9 11.25,9.75 11.25,11.5 19.5,11.5 22.25,8.75 C9.1 | v16.75,2.75 17.25,3.25 17.25,6 16.75,6.5 16.75,7.5
  Bottom 0.127: R59.1 20,2.5 18,2.5 R57.1 17.75,2.5 17.5,2.75 v16.75,2.75
VCAP  (via drill 0.3)
  Top 0.127: v50.75,22 52.75,24 C11.1 | v48.75,21.75 48,21.75 48,22 47.75,22.25 IC1.56
  Bottom 0.127: v50.75,22 50.5,21.75 v48.75,21.75
VCC_USB
  Top 0.127: U5.4 30.75,6.25 30.75,4.5 C7.1 30.75,4.25 30.75,2.5 D9.A 30.75,2.25 32,1 37.5,1 37.5,3 38.5,4 J15.2
  Bottom 0.127: J17.1 33.25,5.25 33.25,6.25 35.25,6.25 37.25,4.25 38.5,4.25 J15.2

### Text on the board
tNames: V | !RESET | V | V | V | | | UART | SPI_1 | I2C_1 | RGB | P1 | P0 | P0 | P1 | MUX_2 | EXT. OSC. | ACCEL. | Buck/Boost | Charger | P2 | P2 | Y | A0 | A1 | A2 | P3 | + / - | P3 | BATT | X | + / - | + / -
bNames: A0 | A1 | A2 | MUX_1 | Buck/Boost | Charger | (; | H.A.L.O. Main Board / Hunter Hykes / 2021/03/01